# Altium project PowerBMS.PrjPcb
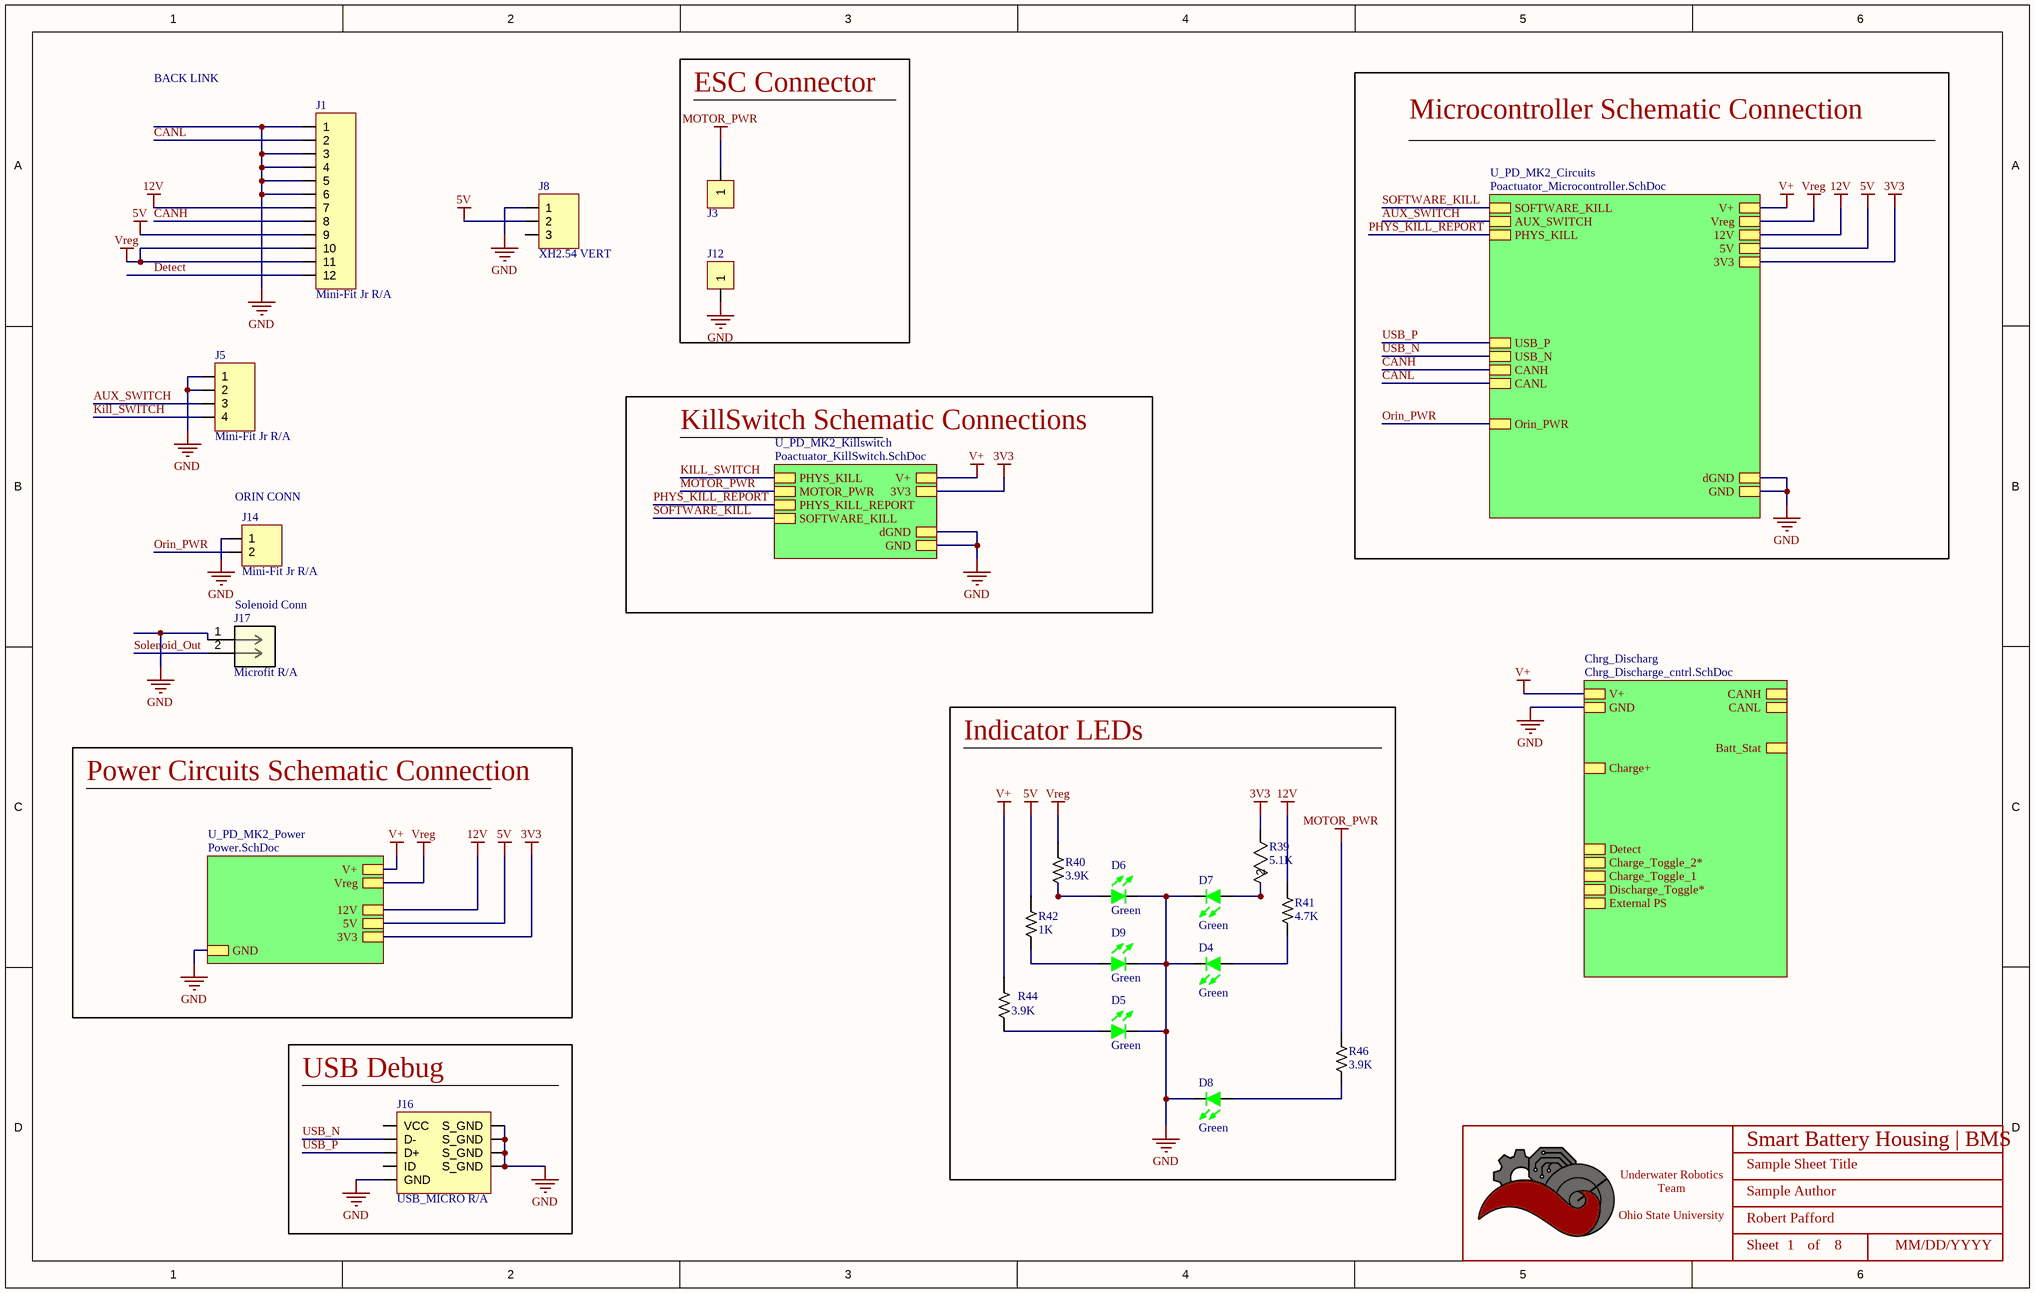
[diagram p0: Poactuator_Connectors.SchDoc]
BoardRevision: 1.1; DateOfDesignReview: 1/10/2022; ProjectTitle: Smart Battery Housing | BMS; TeamLead: Robert Pafford
5 sheets, 144 parts. Net scope: hierarchical (ports join the sheet entries above them; power ports are global).
Board file: SBM_BMS.PcbDoc
Sheets:
  Poactuator_Connectors.SchDoc
    U_PD_MK2_Circuits = Poactuator_Microcontroller.SchDoc
    U_PD_MK2_Killswitch = Poactuator_KillSwitch.SchDoc
    Chrg_Discharg = Chrg_Discharge_cntrl.SchDoc
      BMS = SBH_BMS.SchDoc

## Sheet Poactuator_Connectors.SchDoc: Sample Sheet Title
size B; Date: MM/DD/YYYY; Author: Sample Author; Organization: ORGANIZATION; Address1: ADDRESS 1; Address2: ADDRESS 2; Address3: ADDRESS 3; Address4: ADDRESS 4; Revision: -; SheetNumber: 1; SheetTotal: 8; ENG_APP_DATE: --/--/--; DSN_APP_DATE: --/--/--; CHK_APP_DATE: --/--/--

### Parts
(Parts that share a designator on the sheet are numbered #1, #2 ... from top to bottom, then left to right.)
*#1  Title_Block  [LOGO]  (value not drawn)  (graphical)
D4  Color: Green  [LED_0603]  (hidden comment: IN-S63AT5G)
D5  Color: Green  [LED_0603]  (hidden comment: IN-S63AT5G)
D6  Color: Green  [LED_0603]  (hidden comment: IN-S63AT5G)
D7  Color: Green  [LED_0603]  (hidden comment: IN-S63AT5G)
D8  Color: Green  [LED_0603]  (hidden comment: IN-S63AT5G)
D9  Color: Green  [LED_0603]  (hidden comment: IN-S63AT5G)
J1  Mini-Fit Jr R/A  [CONN_MOLEX_MINIFIT JR_12 POS_R/A]
J3  Redcube M4 Term 85A  [Redcube M4 Term 85A]  (value not drawn)
J5  Mini-Fit Jr R/A  [CONN_MOLEX_MINIFIT JR_4 POS_R/A]
J8  XH2.54 VERT  [CONN_JST_XH254_3POS_VERT]
J12  Redcube M4 Term 85A  [Redcube M4 Term 85A]  (value not drawn)
J14  Mini-Fit Jr R/A  [CONN_MOLEX_MINIFIT JR_2 POS_R/A]
J16  USB_MICRO R/A  [CONN_MINIUSB]
J17  Microfit R/A  [CONN_MOLEX_MICROFIT_2 POS_R/A]
R39  5.1K  [RESISTOR_0603]
R40  Value  (Ohms): 3.9K  [RESISTOR_0603]  (hidden comment: 3.9k Ohm 5% 1/10W)
R41  Value  (Ohms): 4.7K  [RESISTOR_0603]  (hidden comment: 4.7k Ohm 5% 1/10W)
R42  Value  (Ohms): 1K  [RESISTOR_0603]  (hidden comment: 1k Ohm 5% 1/8W)
R44  Value  (Ohms): 3.9K  [RESISTOR_0603]  (hidden comment: 3.9k Ohm 5% 1/10W)
R46  Value  (Ohms): 3.9K  [RESISTOR_0603]  (hidden comment: 3.9k Ohm 5% 1/10W)

### Blocks framed on the sheet
ESC Connector: J3 J12
Indicator LEDs: D4-D9 R39-R42 R44 R46
USB Debug: J16

### Sub-sheets
Chrg_Discharg = Chrg_Discharge_cntrl.SchDoc: CANH, CANL, V+, GND, Detect, Batt_Stat, Charge+, Charge_Toggle_2*, Charge_Toggle_1, Discharge_Toggle*, External PS
U_PD_MK2_Circuits = Poactuator_Microcontroller.SchDoc: GND, V+, 5V, 3V3, SOFTWARE_KILL, AUX_SWITCH, 12V, dGND, Vreg, USB_P, USB_N, CANH, CANL, PHYS_KILL, Orin_PWR
U_PD_MK2_Killswitch = Poactuator_KillSwitch.SchDoc: PHYS_KILL_REPORT, MOTOR_PWR, V+, 3V3, dGND, GND, PHYS_KILL, SOFTWARE_KILL
U_PD_MK2_Power = Power.SchDoc (file not in this document): GND, V+, 5V, 3V3, Vreg, 12V

### Nets
3V3: R39.1 ; sheet U_PD_MK2_Power/3V3, sheet U_PD_MK2_Circuits/3V3, sheet U_PD_MK2_Killswitch/3V3
5V: J1.9 J8.2 R42.1 ; sheet U_PD_MK2_Power/5V, sheet U_PD_MK2_Circuits/5V
12V: J1.7 R41.1 ; sheet U_PD_MK2_Power/12V, sheet U_PD_MK2_Circuits/12V
GND: D4.2 D5.2 D6.2 D7.2 D8.2 D9.2 J1.1 J1.3 J1.4 J1.5 J1.6 J5.1 J5.2 J8.1 J12.1 J14.1 J16.5(GND) J16.6(S_GND) J16.7(S_GND) J16.8(S_GND) J16.9(S_GND) J17.1 ; sheet U_PD_MK2_Power/GND, sheet U_PD_MK2_Circuits/GND, sheet U_PD_MK2_Circuits/dGND, sheet U_PD_MK2_Killswitch/dGND, sheet U_PD_MK2_Killswitch/GND, sheet Chrg_Discharg/GND  [project net dGND]
MOTOR_PWR: J3.1 R46.1 ; sheet U_PD_MK2_Killswitch/MOTOR_PWR
V+: R44.1 ; sheet U_PD_MK2_Power/V+, sheet U_PD_MK2_Circuits/V+, sheet U_PD_MK2_Killswitch/V+, sheet Chrg_Discharg/V+
Vreg: J1.10 J1.11 R40.1 ; sheet U_PD_MK2_Power/Vreg, sheet U_PD_MK2_Circuits/Vreg
AUX_SWITCH: J5.3 ; sheet U_PD_MK2_Circuits/AUX_SWITCH
CANH: J1.8 ; sheet U_PD_MK2_Circuits/CANH
CANL: J1.2 ; sheet U_PD_MK2_Circuits/CANL
Detect: J1.12
KILL_SWITCH: J5.4 ; sheet U_PD_MK2_Killswitch/PHYS_KILL
Orin_PWR: J14.2 ; sheet U_PD_MK2_Circuits/Orin_PWR
PHYS_KILL_REPORT: sheet U_PD_MK2_Circuits/PHYS_KILL, sheet U_PD_MK2_Killswitch/PHYS_KILL_REPORT
SOFTWARE_KILL: sheet U_PD_MK2_Circuits/SOFTWARE_KILL, sheet U_PD_MK2_Killswitch/SOFTWARE_KILL
Solenoid_Out: J17.2
USB_N: J16.2(D-) ; sheet U_PD_MK2_Circuits/USB_N
USB_P: J16.3(D+) ; sheet U_PD_MK2_Circuits/USB_P
NetD4_1: D4.1 R41.2
NetD5_1: D5.1 R44.2
NetD6_1: D6.1 R40.2
NetD7_1: D7.1 R39.2
NetD8_1: D8.1 R46.2
NetD9_1: D9.1 R42.2

Not connected (* = marked no-connect by the designer): J8 3; J16 1(VCC) 4(ID)

### Notes on the sheet
- BACK LINK
- Microcontroller Schematic Connection
- KillSwitch Schematic Connections
- (near J14) ORIN CONN
- (near J17) Solenoid Conn
- Power Circuits Schematic Connection
- DWG. NO.
- REV.
- SHT.
- THIS DOCUMENT AND THE DATA DISCLOSED HEREIN OR HEREWITH IS THE PROPERTY OF ALTIUM LIMITED AND MAY BE FREELY DISTRIBUTED IN WHOLE. NO RIGHTS ARE RESERVED OR EXPRESS OR IMPLIED WARANTEE GIVEN.
- REVISION
- DESCRIPTION
- DATE
- APPROVED
- ENG:
- APPROVALS
- PROJECT
- DSN:
- CHK:
- REFERENCE DOCUMENTS
- PROJECT REVISION:
- TITLE
- DOCUMENT REVISION:
- DESIGN ITEM:
- BOM:
- FAB DWG:
- PCB DWG:
- ASSY DWG:
- SCALE:
- SIZE
- B
- CAGE CODE
- FILE NAME
- DWG NO.
- SHEET
- OF
- REV
- (in symbol Title_Block) Underwater Robotics Team / Ohio State University; Sheet; of

### Library data of the parts
*#1 = Title_Block: UWRT Schematic Title Block Template / Created June 2021, Dylan Trainor
D4-D9 = LED_Green_0603_3V: LED Green Vf= 3V If = 0.005A / IN-S63AT5G; Made By: Robert Pafford; Forward Current: 5mA; ComponentLink1Description: Datasheet; ComponentLink1URL: https://www.we-online.de/katalog/datasheet/150060GS75000.pdf; Forward Voltage: 3V; Package: 0603; Supplier 1: Digi-Key; Supplier Part Number 1: 1830-1062-1-ND
J1 = CONN_MOLEX_MINIFIT JR_12POS_R/A: Molex Minifit Jr. 5569 / 12 Pos R/A Natural; Pitch: 4.2mm; Configuration: Right Angle; Current Per Pin: 13A; Number of Positions: 12; Manufacturer: Molex; Color: Natural; Created By: Flip B; ComponentLink1Description: Datasheet; ComponentLink1URL: https://www.molex.com/pdm_docs/ps/PS-5556-001.pdf; Series: Minifit Jr 5569; Supplier 1: Digi-Key; Supplier Part Number 1: WM21356-ND
J5 = CONN_MOLEX_MINIFIT JR_4POS_R/A: Molex Minifit Jr. 5569 / 4 Pos R/A Natural; Pitch: 4.2mm; Configuration: Right Angle; Current Per Pin: 13A; Number of Positions: 4; Supplier Part Number 1: WM13112-ND; Supplier 1: Digi-Key; Manufacturer: Molex; Color: Natural; Created By: Flip B; ComponentLink1Description: Datasheet; ComponentLink1URL: https://www.molex.com/pdm_docs/sd/026013115_sd.pdf; Series: Minifit Jr 5569
J8 = CONN_JST_XH254_3POS_VERT: JST XH 2.54mm Pitch 3 Pos Vertical; Current Per Pin: 4A; Number of Positions: 3; NOTE: Do not use JST 2.5mm parts with this footprint. JST does not make 2.54mm pitch pins, rather only clones make this connector!; Manufacturer: JST; Pitch: 2.54mm; Configuration: Vertical; Color: White; Created By: Robert P; Series: XH 2.54; ComponentLink1Description: Purchase Link; ComponentLink1URL: https://www.amazon.com/460PCS-XH2-54-Connector-Terminal-Connectors/dp/B09DBGVX5C
J14 = CONN_MOLEX_MINIFIT JR_2POS_R/A: Molex Minifit Jr. 5569 / 2 Pos R/A Natural; Pitch: 4.2mm; Configuration: Right Angle; Current Per Pin: 13A; Number of Positions: 2; Manufacturer: Molex; Color: Natural; Created By: Robert P; ComponentLink1Description: Datasheet; ComponentLink1URL: https://www.molex.com/pdm_docs/sd/026013115_sd.pdf; Series: Minifit Jr 5569; Supplier 1: Digi-Key; Supplier Part Number 1: WM1351-ND
J16 = CONN_MICROUSB: Amphenol Micro USB-B / USB2.0 5 Pin Right Angle SMD; Pitch: 0.65mm; Current Per Pin: 1.8A; Number of Positions: 5; Manufacturer: Amphenol; Configuration: Right Angle; Color: Silver; Created By: Flip B; ComponentLink1Description: Datasheet; ComponentLink1URL: https://cdn.amphenol-icc.com/media/wysiwyg/files/documentation/datasheet/inputoutput/io_usb_micro.pdf?__cf_chl_jschl_tk__=05693735e19256298f6ef6ca2bb2e65c376a4f56-1625503833-0-Abitsb0-ufjOXJYs_S3J3r2iTn-nObalbmXUksF1VvO_h_WEmRdMlUD1I8-hmWSEVWzY1pirKnrPZWfgY3851qyBZe5ZvnNQePLGIzUgdEIQBVUyW36RsbYpDLEWxJ4horD-5gChFgobLYqwmG5aHl0E8lIn_twwPPrOxilK2gP0q9t_CNOs_u5fMqXvXUrlsOv8tIE2NRlu6NVP8qtkL2GjhlkeTUbDMF8WvvpPDTFOgvZ4Y16Ej8F8AhWos88mo5B1HssXozw0XrkJQIqERITUu6rqloz9kf4ZzhBHtDAt-IkiAFY_Ds9SW8FYKKTtINJVpHZQ6Gyu1FFM4Dc9MO0maE8_mmNcwlxqyRoRk_MPWW8VyByXWM5RSp52jteRKw7FeI9WIYvCbPAOy0Eyib-aseIQsnGbglBcUY6_2xp8GYaJM38H3dNvBPsSOfJBPndKedwKHllxjkucXn6xsN0sDXkpGN-cu8_2bDTJ0g-uUucKSCooYX-ApSDNGpkA_p9zv1SOAD8c0zaZVmtiBsN75QpVz2rzq9_BFxOywPvR; Series: 10118192; Supplier 1: Digi-Key; Supplier Part Number 1: 609-4613-1-ND
J17 = CONN_MOLEX_MICROFIT_2 POS_R/A: CONN HEADER R/A 2POS; Manufacturer: Molex; Pitch: 3mm; Current Rating: 8A; Supplier 1: Digikey; Supplier Part Number 1: WM1813-ND; Configuration: R/A; Color: Black
R39 = ERA-3AEB512V_2: 5.1 kOhms ±0.1% 0.1W, 1/10W Chip Resistor 0603 (1608 Metric) Automotive AEC-Q200 Thin Film; Mfr_Name: Panasonic; Copyright: Copyright (C) 2023 Ultra Librarian. All rights reserved.; Manufacturer_Part_Number: ERA-3AEB512V; RefDes: RefDes; Type: DEV
R40 R44 R46 = RESISTOR_3.9K_0603: RES 3.9k OHM 1% 1/10W 0603; Tolerance: +/- 1%; Made By: Robert Pafford; Wattage: 1/10W; Supplier 1: Digi-Key; Supplier Part Number 1: P3.90KHCT-ND
R41 = RESISTOR_4.7K_0603: RES 4.7k OHM 5% 1/10W 0603; Tolerance: +/- 5%; Made By: Robert Pafford; Wattage: 1/10W; Supplier: Digikey; Digikey Part Numer: CR0603-JW-104ELFTR-ND; Supplier 1: Digi-Key; Supplier Part Number 1: RMCF0603JT4K70CT-ND
R42 = RESISTOR_1K_0603: RES 1k OHM 5% 1/8W 0603; Tolerance: +/- 5%; Made By: Robert Pafford; ComponentLink1Description: Datasheet; ComponentLink1URL: https://www.bourns.com/docs/product-datasheets/CRxxxxx.pdf; Wattage: 1/8W; Supplier: Digikey; Digikey Part Numer: CR0603-JW-104ELFTR-ND; Supplier 1: Digi-Key; Supplier Part Number 1: 2019-RK73B1JTTD102JCT-ND
J3 J12 = Redcube M4 Term 85A: Created By: Nahtan Ayer; Current Rating: 85 A; Screw Size: M4

## Sheet Poactuator_Microcontroller.SchDoc: Sample Sheet Title
size B; Date: MM/DD/YYYY; Author: Sample Author; Organization: ORGANIZATION; Address1: ADDRESS 1; Address2: ADDRESS 2; Address3: ADDRESS 3; Address4: ADDRESS 4; Revision: -; SheetNumber: 5; SheetTotal: 8; ENG_APP_DATE: --/--/--; DSN_APP_DATE: --/--/--; CHK_APP_DATE: --/--/--
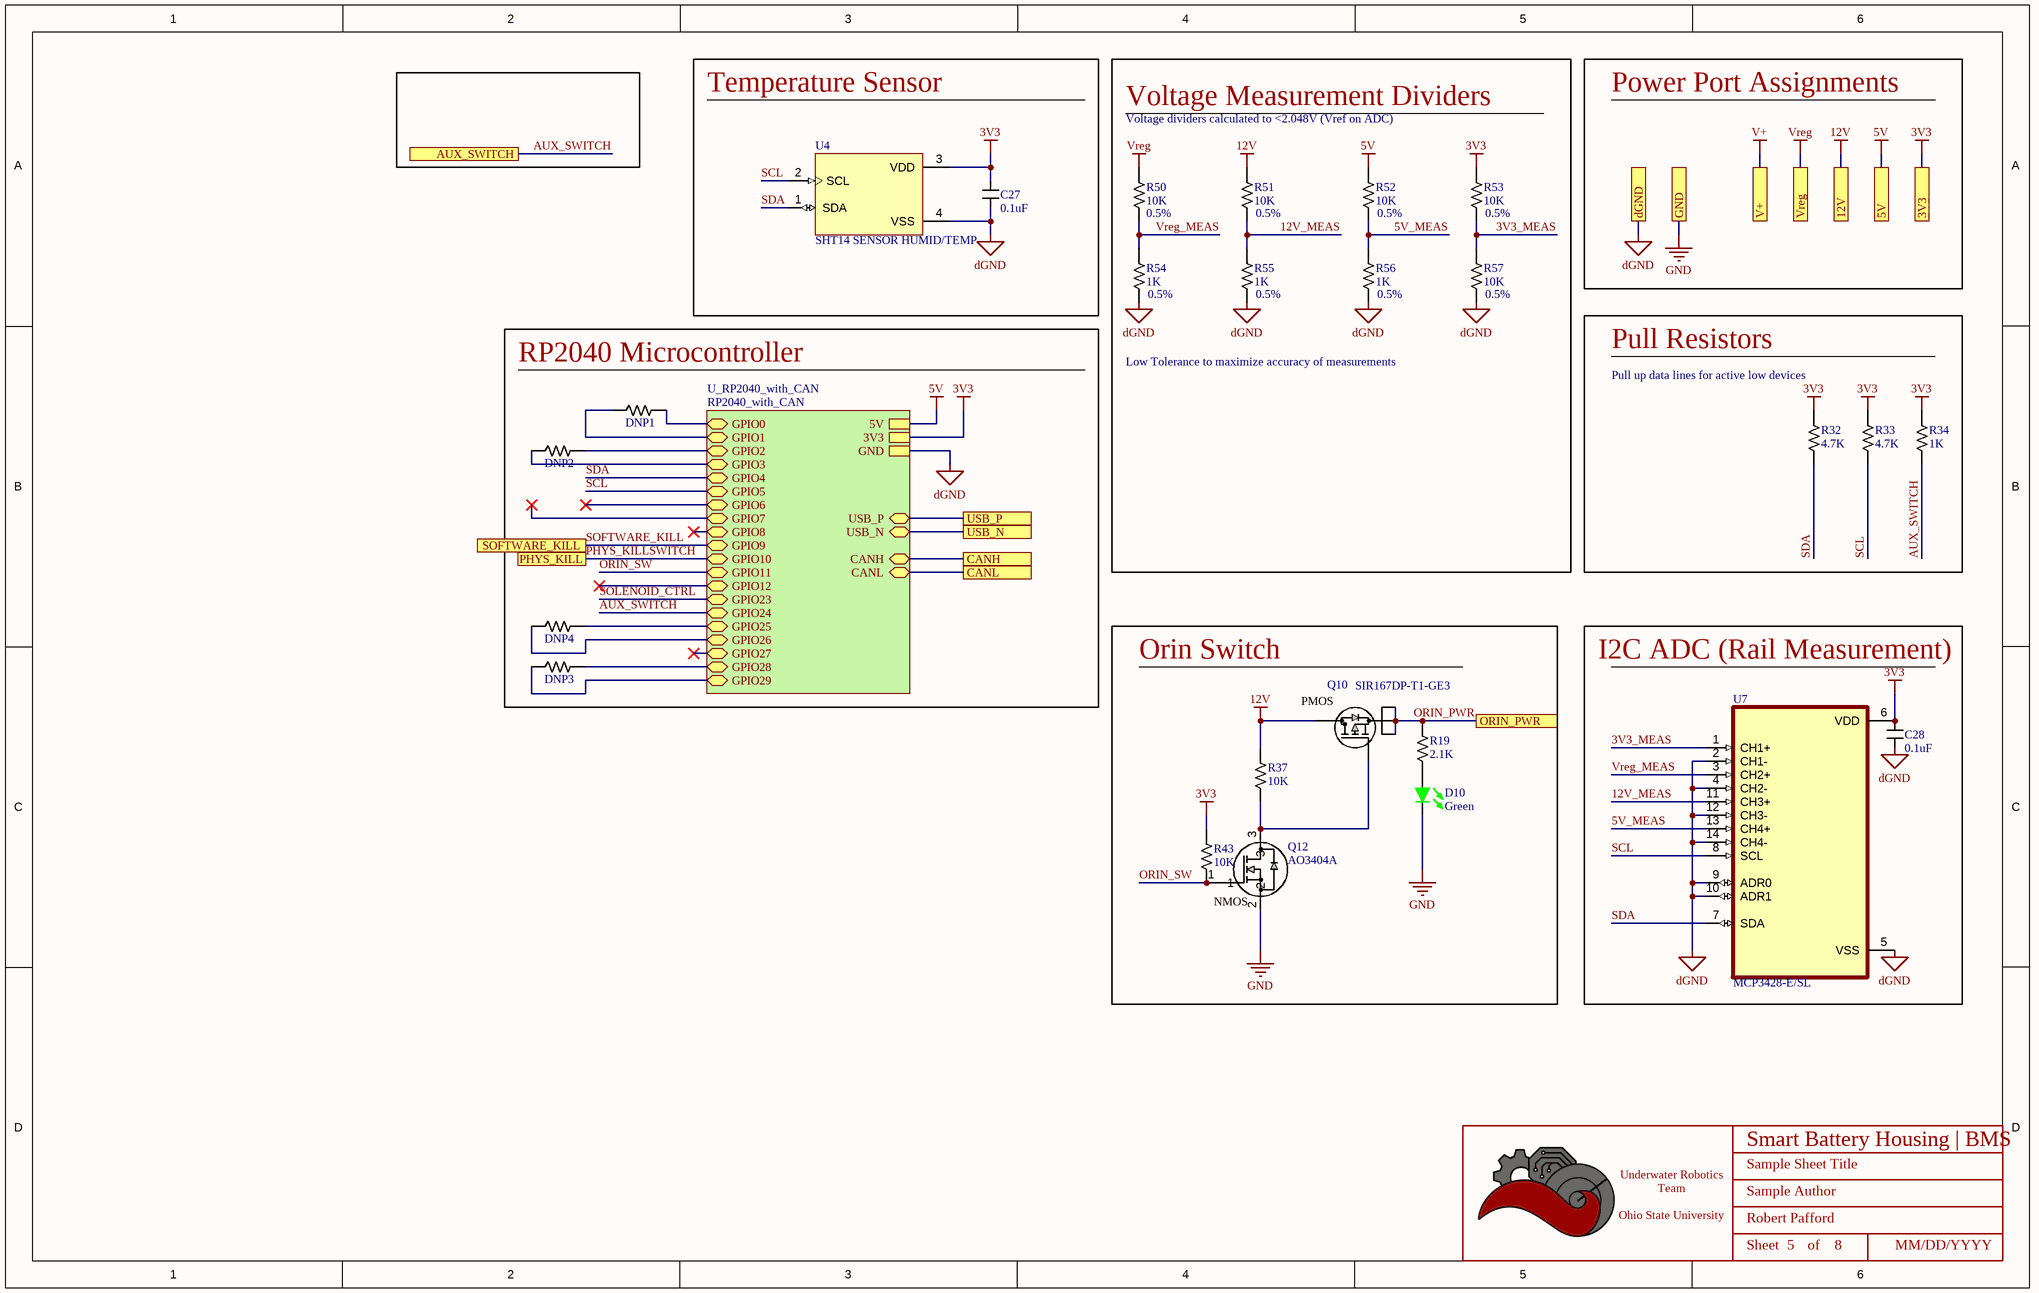
[diagram p1: Poactuator_Microcontroller.SchDoc]

### Parts
(Parts that share a designator on the sheet are numbered #1, #2 ... from top to bottom, then left to right.)
*#2  Title_Block  [LOGO]  (value not drawn)  (graphical)
C27  value 0.1uF  [CAPACITOR_0603]  (hidden comment: 100nF Ceramic 6.3V)
C28  value 0.1uF  [CAPACITOR_0603]  (hidden comment: 100nF Ceramic 6.3V)
D10  Color: Green  [LED_0603]  (hidden comment: IN-S63AT5G)
DNP1  DNP  [RESISTOR_0402]  (value not drawn)
DNP2  DNP  [RESISTOR_0402]  (value not drawn)
DNP3  DNP  [RESISTOR_0402]  (value not drawn)
DNP4  DNP  [RESISTOR_0402]  (value not drawn)
Q10  SIR167DP-T1-GE3  [MOSFET_7DP-T1-GE3_VIS]
Q12  AO3404A  [SOT-23-3]
R19  Value  (Ohms): 2.1K  [RESISTOR_0603]  (hidden comment: 2.1k Ohm 5% 1/8W)
R32  Value  (Ohms): 4.7K  [RESISTOR_0603]  (hidden comment: 4.7k Ohm 5% 1/10W)
R33  Value  (Ohms): 4.7K  [RESISTOR_0603]  (hidden comment: 4.7k Ohm 5% 1/10W)
R34  Value  (Ohms): 1K  [RESISTOR_0603]  (hidden comment: 1k Ohm 5% 1/8W)
R37  Value  (Ohms): 10K  [RESISTOR_0603]  (hidden comment: 10k Ohm 5% 1/10W)
R43  Value  (Ohms): 10K  [RESISTOR_0603]  (hidden comment: 10k Ohm 5% 1/10W)
R50  Value  (Ohms): 10K  [RESISTOR_0603]  (hidden comment: 10k Ohm 0.5% 1/10W)
R51  Value  (Ohms): 10K  [RESISTOR_0603]  (hidden comment: 10k Ohm 0.5% 1/10W)
R52  Value  (Ohms): 10K  [RESISTOR_0603]  (hidden comment: 10k Ohm 0.5% 1/10W)
R53  Value  (Ohms): 10K  [RESISTOR_0603]  (hidden comment: 10k Ohm 0.5% 1/10W)
R54  Value  (Ohms): 1K  [RESISTOR_0603]  (hidden comment: 1k Ohm 5% 1/10W)
R55  Value  (Ohms): 1K  [RESISTOR_0603]  (hidden comment: 1k Ohm 5% 1/10W)
R56  Value  (Ohms): 1K  [RESISTOR_0603]  (hidden comment: 1k Ohm 5% 1/10W)
R57  Value  (Ohms): 10K  [RESISTOR_0603]  (hidden comment: 10k Ohm 0.5% 1/10W)
U4  SHT14 SENSOR HUMID/TEMP  [XDCR_SHT41-AD1B-R2]
U7  MCP3428-E/SL  [SOIC127P600X175-14N]

### Blocks framed on the sheet
Temperature Sensor: C27 U4
RP2040 Microcontroller: DNP1-DNP4
Pull Resistors: R32-R34
Orin Switch: D10 Q10 Q12 R19 R37 R43
I2C ADC (Rail Measurement): C28 U7

### Sub-sheets
U_RP2040_with_CAN = RP2040_with_CAN (file not in this document): USB_P (bidir), USB_N (bidir), 5V, CANH (bidir), CANL (bidir), GPIO0 (bidir), GPIO1 (bidir), GPIO2 (bidir), GPIO3 (bidir), GPIO4 (bidir), GPIO5 (bidir), GPIO6 (bidir), GPIO7 (bidir), GPIO8 (bidir), GPIO9 (bidir), GPIO10 (bidir), GPIO11 (bidir), GPIO12 (bidir), GPIO23 (bidir), GPIO24 (bidir), GPIO25 (bidir), GPIO26 (bidir), GPIO27 (bidir), GPIO28 (bidir), GPIO29 (bidir), 3V3, GND

### Ports
3V3, 5V, 12V, AUX_SWITCH, CANH, CANL, dGND, GND, ORIN_PWR, PHYS_KILL, SOFTWARE_KILL, USB_N, USB_P, V+, Vreg

### Nets
3V3: C27.1 C28.1 R32.1 R33.1 R34.1 R43.1 R53.1 U4.3(VDD) U7.6(VDD) ; port 3V3, sheet U_RP2040_with_CAN/3V3
5V: R52.1 ; port 5V, sheet U_RP2040_with_CAN/5V
12V: Q10.D R37.1 R51.1 ; port 12V
dGND: C27.2 C28.2 D10.2 Q12.2 R54.2 R55.2 R56.2 R57.2 U4.4(VSS) U7.2(CH1-) U7.4(CH2-) U7.5(VSS) U7.9(ADR0) U7.10(ADR1) U7.12(CH3-) U7.14(CH4-) ; port GND, port dGND, sheet U_RP2040_with_CAN/GND  [also labelled GND]
Vreg: R50.1 ; port Vreg
3V3_MEAS: R53.2 R57.1 U7.1(CH1+)
5V_MEAS: R52.2 R56.1 U7.13(CH4+)
12V_MEAS: R51.2 R55.1 U7.11(CH3+)
AUX_SWITCH: R34.2 ; port AUX_SWITCH, sheet U_RP2040_with_CAN/GPIO24
CANH: port CANH, sheet U_RP2040_with_CAN/CANH
CANL: port CANL, sheet U_RP2040_with_CAN/CANL
Orin_PWR: Q10.1(S) Q10.2(S) Q10.3(S) R19.1 ; port ORIN_PWR
ORIN_SW: Q12.1 R43.2 ; sheet U_RP2040_with_CAN/GPIO11
PHYS_KILLSWITCH: port PHYS_KILL, sheet U_RP2040_with_CAN/GPIO10  [project net PHYS_KILL_REPORT]
SCL: R33.2 U4.2(SCL) U7.8(SCL) ; sheet U_RP2040_with_CAN/GPIO5
SDA: R32.2 U4.1(SDA) U7.7(SDA) ; sheet U_RP2040_with_CAN/GPIO4
SOFTWARE_KILL: port SOFTWARE_KILL, sheet U_RP2040_with_CAN/GPIO9
SOLENOID_CTRL: sheet U_RP2040_with_CAN/GPIO23
USB_N: port USB_N, sheet U_RP2040_with_CAN/USB_N
USB_P: port USB_P, sheet U_RP2040_with_CAN/USB_P
Vreg_MEAS: R50.2 R54.1 U7.3(CH2+)
NetD10_1: D10.1 R19.2
NetDNP1_1: DNP1.1 ; sheet U_RP2040_with_CAN/GPIO0
NetDNP1_2: DNP1.2 ; sheet U_RP2040_with_CAN/GPIO1
NetDNP2_1: DNP2.1 ; sheet U_RP2040_with_CAN/GPIO2
NetDNP2_2: DNP2.2 ; sheet U_RP2040_with_CAN/GPIO3
NetDNP3_1: DNP3.1 ; sheet U_RP2040_with_CAN/GPIO28
NetDNP3_2: DNP3.2 ; sheet U_RP2040_with_CAN/GPIO29
NetDNP4_1: DNP4.1 ; sheet U_RP2040_with_CAN/GPIO25
NetDNP4_2: DNP4.2 ; sheet U_RP2040_with_CAN/GPIO26
NetQ10_4: Q10.4(G) Q12.3 R37.2

### Notes on the sheet
- Power Port Assignments
- Voltage Measurement Dividers
- Voltage dividers calculated to <2.048V (Vref on ADC)
- (near R50) 0.5%
- (near R51) 0.5%
- (near R52) 0.5%
- (near R53) 0.5%
- (near R54) 0.5%
- (near R55) 0.5%
- (near R56) 0.5%
- (near R57) 0.5%
- Low Tolerance to maximize accuracy of measurements
- Pull up data lines for active low devices
- DWG. NO.
- REV.
- SHT.
- THIS DOCUMENT AND THE DATA DISCLOSED HEREIN OR HEREWITH IS THE PROPERTY OF ALTIUM LIMITED AND MAY BE FREELY DISTRIBUTED IN WHOLE. NO RIGHTS ARE RESERVED OR EXPRESS OR IMPLIED WARANTEE GIVEN.
- REVISION
- DESCRIPTION
- DATE
- APPROVED
- ENG:
- APPROVALS
- PROJECT
- DSN:
- CHK:
- REFERENCE DOCUMENTS
- PROJECT REVISION:
- TITLE
- DOCUMENT REVISION:
- DESIGN ITEM:
- BOM:
- FAB DWG:
- PCB DWG:
- ASSY DWG:
- SCALE:
- SIZE
- B
- CAGE CODE
- FILE NAME
- DWG NO.
- SHEET
- OF
- REV
- (in symbol AO3404A) NMOS
- (in symbol SIR167DP-T1-GE3) PMOS
- (in symbol Title_Block) Underwater Robotics Team / Ohio State University; Sheet; of

### Library data of the parts
*#2 = Title_Block: as *#1 on sheet Poactuator_Connectors
C27 C28 = CAPACITOR_0.1uF_0603: Cap 100nF 6.3V +/-10% / Ceramic 0603; Made By: Flip B; ComponentLink1Description: Datsheet; ComponentLink1URL: https://www.mouser.com/datasheet/2/212/KEM_C1002_X7R_SMD-1102033.pdf; Tolerance: +/- 10%; Voltage: 6.3V; Supplier 1: Digi-Key; Supplier Part Number 1: 399-15351-1-ND
D10 = LED_Green_0603_3V: as D4 on sheet Poactuator_Connectors; ComponentLink1Description: Datasheet; ComponentLink1URL: https://www.we-online.de/katalog/datasheet/150060GS75000.pdf; Forward Voltage: 3V; Package: 0603; Supplier 1: Digi-Key; Supplier Part Number 1: 1830-1062-1-ND
DNP1-DNP4 = DNP_0402: Do Not Populate 0402
Q10 = SIR167DP-T1-GE3: P-Channel 30 V 60A (Tc) 65.8W (Tc) Surface Mount PowerPAK® SO-8; Mfr_Name: Vishay; Type: DEV; Copyright: Copyright (C) 2022 Ultra Librarian. All rights reserved.; Manufacturer_Part_Number: SIR167DP-T1-GE3; RefDes: RefDes; Supplier 1: Mouser; Supplier Part Number 1: 78-SIR167DP-T1-GE3
Q12 = AO3404A: N-Channel 30 V 5.8A (Ta) 1.4W (Ta) Surface Mount SOT-23-3; Vendor: Alpha & Omega Semiconductor Inc.; SourceLibrary: ON_Semiconductor_2020-01-13; Vgs (Max): 3V @ 5.8A, 10V; Vgs (th): 3V @ 250µA; Vdss: 30V; Rds (on): 28mOhm @ 5.8A, 10V; Amp Rating: 5.8 A; FET Type: N-Channel; Package: SOT23-3L; Manufacturer _Part_Number: AO3404A; Power Dissipation: 1.4W (Ta); Supplier 1: Digi-Key; Supplier Part Number 1: 785-1004-1-ND; Created By: Dylan T
R19 = RESISTOR_2.1K_0603: RES 2.1k OHM 5% 1/8W 0603; Tolerance: +/- 5%; Made By: Robert Pafford; ComponentLink1Description: Datasheet; ComponentLink1URL: https://www.bourns.com/docs/product-datasheets/CRxxxxx.pdf; Wattage: 1/8W; Supplier: Digikey; Digikey Part Numer: CR0603-JW-104ELFTR-ND; Supplier 1: Digi-Key; Supplier Part Number 1: YAG1852CT-ND
R32 R33 = RESISTOR_4.7K_0603: as R41 on sheet Poactuator_Connectors; Wattage: 1/10W; Supplier: Digikey; Digikey Part Numer: CR0603-JW-104ELFTR-ND; Supplier 1: Digi-Key; Supplier Part Number 1: RMCF0603JT4K70CT-ND
R34 = RESISTOR_1K_0603: as R42 on sheet Poactuator_Connectors; ComponentLink1Description: Datasheet; ComponentLink1URL: https://www.bourns.com/docs/product-datasheets/CRxxxxx.pdf; Wattage: 1/8W; Supplier: Digikey; Digikey Part Numer: CR0603-JW-104ELFTR-ND; Supplier 1: Digi-Key; Supplier Part Number 1: 2019-RK73B1JTTD102JCT-ND
R37 R43 = RESISTOR_10K_0603: RES 10k OHM 5% 1/10W 0603; Tolerance: +/- 5%; Wattage: 1/8W; Made By: Robert Pafford; ComponentLink1Description: Datasheet; ComponentLink1URL: https://www.bourns.com/docs/product-datasheets/CRxxxxx.pdf; Supplier: Digikey; Digikey Part Numer: CR0603-JW-104ELFTR-ND; Supplier 1: Digi-Key; Supplier Part Number 1: 2019-RK73B1JTTD103JCT-ND
R50-R53 R57 = RESISTOR_10K_0.5%_0603: RES 10k OHM 0.5% 1/10W 0603; Tolerance: +/- 0.5%; Made By: Robert Pafford; Wattage: 1/10W; Supplier: Digikey; Digikey Part Numer: CR0603-JW-104ELFTR-ND; Supplier 1: Digi-Key; Supplier Part Number 1: 749-1695-1-ND
R54-R56 = RESISTOR_1K_0.5%_0603: RES 1k OHM 0.5% 1/10W 0603; Tolerance: +/- 0.5%; Made By: Robert Pafford; Wattage: 1/10W; Supplier: Digikey; Digikey Part Numer: CR0603-JW-104ELFTR-ND; Supplier 1: Digi-Key; Supplier Part Number 1: 749-1693-1-ND
U4 = SHT41-AD1B-R2: Digital Relative Humidity Temperature Sensor, Â±1.8 / max 2.5 %RH, Â±0.2 Â°C, Ultra-Low-Power; MF: Sensirion; Price: None; SnapEDA_Link: https://www.snapeda.com/parts/SHT41-AD1B-R2/Sensirion/view-part/?ref=snap; MP: SHT41-AD1B-R2; Purchase-URL: https://pricing.snapeda.com/search/part/SHT41-AD1B-R2/?ref=eda; Value: *; Availability: In Stock; Package: None; Check_prices: https://www.snapeda.com/parts/SHT41-AD1B-R2/Sensirion/view-part/?ref=eda; Supplier 1: Digi-Key; Supplier Part Number 1: 1649-SHT41-AD1B-R2CT-ND
U7 = MCP3428-E/SL: 16 Bit Analog to Digital Converter 4 Input 1 Sigma-Delta 14-SOIC; MF: Microchip; Package: SOIC-14 Microchip; SnapEDA_Link: https://www.snapeda.com/parts/MCP3428-E/SL/Microchip/view-part/13249/?ref=snap; MP: MCP3428-E/SL; Price: None; Availability: Unavailable; Value: *; Supplier 1: Digikey; Supplier Part Number 1: MCP3428-E/SL-ND

## Sheet Poactuator_KillSwitch.SchDoc: Sample Sheet Title
size B; Date: MM/DD/YYYY; Author: Sample Author; Organization: ORGANIZATION; Address1: ADDRESS 1; Address2: ADDRESS 2; Address3: ADDRESS 3; Address4: ADDRESS 4; Revision: -; SheetNumber: 4; SheetTotal: 7; ENG_APP_DATE: --/--/--; DSN_APP_DATE: --/--/--; CHK_APP_DATE: --/--/--
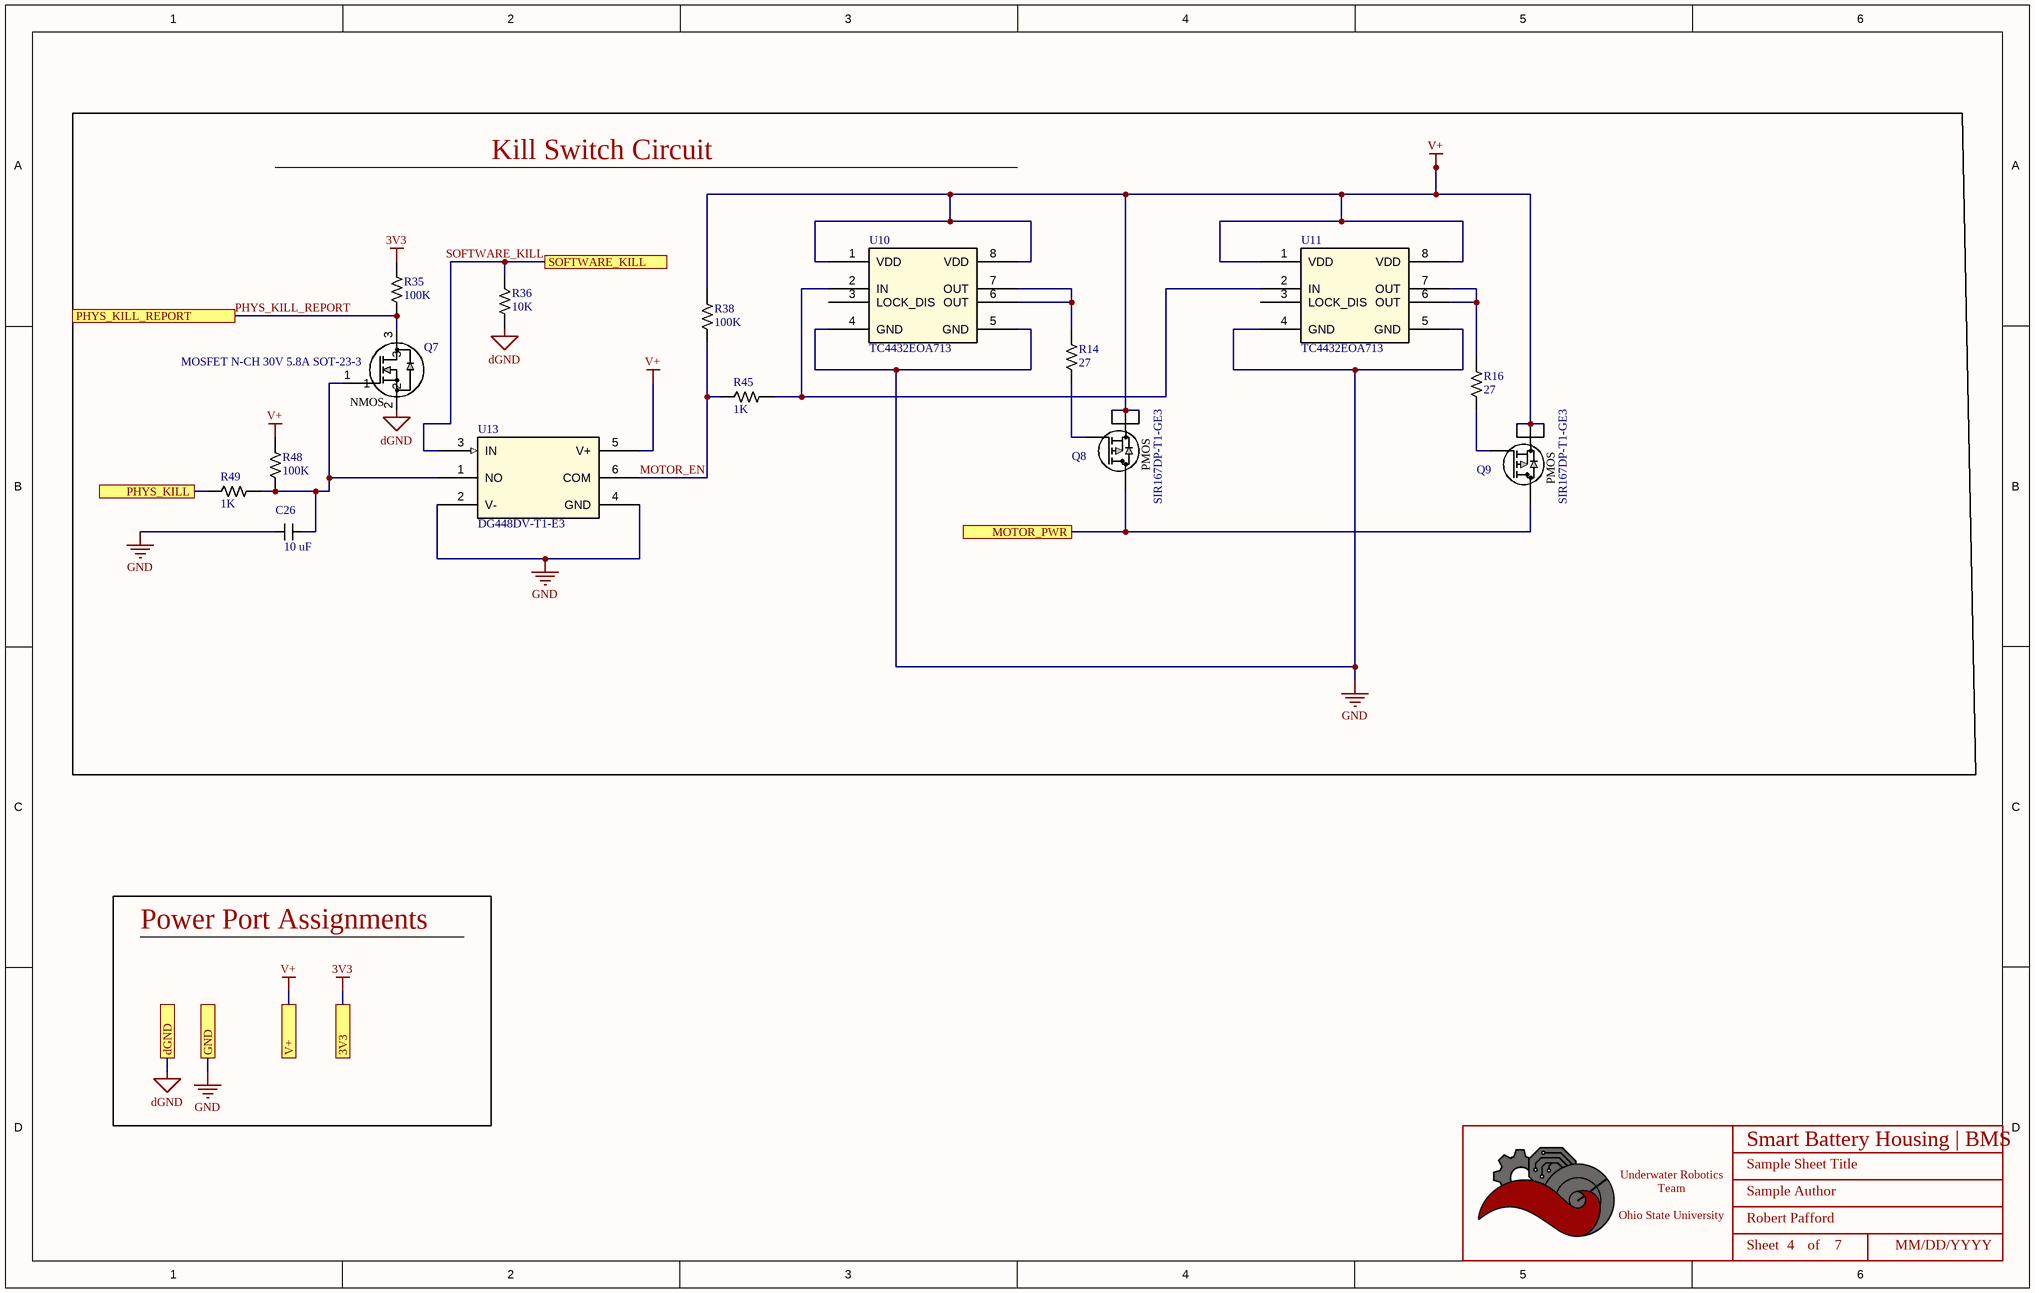
[diagram p2: Poactuator_KillSwitch.SchDoc]

### Parts
(Parts that share a designator on the sheet are numbered #1, #2 ... from top to bottom, then left to right.)
*#3  Title_Block  [LOGO]  (value not drawn)  (graphical)
C26  Value (uF): 10 uF  [CAPACITOR_1206]  (hidden comment: 10uF Ceramic 25V)
Q7  MOSFET N-CH 30V 5.8A SOT-23-3  [SOT-23-3]
Q8  SIR167DP-T1-GE3  [MOSFET_7DP-T1-GE3_VIS]
Q9  SIR167DP-T1-GE3  [MOSFET_7DP-T1-GE3_VIS]
R14  Value  (Ohms): 27  [RESISTOR_0603]  (hidden comment: 27 Ohm 5% 1/8W)
R16  Value  (Ohms): 27  [RESISTOR_0603]  (hidden comment: 27 Ohm 5% 1/8W)
R35  Value  (Ohms): 100K  [RESISTOR_0603]  (hidden comment: 100k Ohm 0.5% 1/10W)
R36  Value  (Ohms): 10K  [RESISTOR_0603]  (hidden comment: 10k Ohm 5% 1/10W)
R38  Value  (Ohms): 100K  [RESISTOR_0603]  (hidden comment: 100k Ohm 5% 1/8W)
R45  Value  (Ohms): 1K  [RESISTOR_0402]  (hidden comment: 1k Ohm 1% 1/16W)
R48  Value  (Ohms): 100K  [RESISTOR_0603]  (hidden comment: 100k Ohm 0.5% 1/10W)
R49  Value  (Ohms): 1K  [RESISTOR_0603]  (hidden comment: 1k Ohm 5% 1/8W)
U10  TC4432EOA713  [SOIC8-N_MC_MCH]
U11  TC4432EOA713  [SOIC8-N_MC_MCH]
U13  DG448DV-T1-E3  [TSOP6_DG_VIS-M]

### Blocks framed on the sheet
Kill Switch Circuit: C26 Q7-Q9 R14 R16 R35 R36 R38 R45 R48 R49 U10 U11 U13

### Ports
3V3, dGND, GND, MOTOR_PWR, PHYS_KILL, PHYS_KILL_REPORT, SOFTWARE_KILL, V+

### Nets
3V3: R35.1 ; port 3V3
dGND: C26.2 Q7.2 R36.1 U10.4(GND) U10.5(GND) U11.4(GND) U11.5(GND) U13.2(V-) U13.4(GND) ; port GND, port dGND  [also labelled GND]
MOTOR_PWR: Q8.D Q9.D ; port MOTOR_PWR
V+: Q8.1(S) Q8.2(S) Q8.3(S) Q9.1(S) Q9.2(S) Q9.3(S) R38.1 R48.1 U10.1(VDD) U10.8(VDD) U11.1(VDD) U11.8(VDD) U13.5(V+) ; port V+
KILL_SWITCH: R49.2 ; port PHYS_KILL
MOTOR_EN: R38.2 R45.2 U13.6(COM)
PHYS_KILL_REPORT: Q7.3 R35.2 ; port PHYS_KILL_REPORT
SOFTWARE_KILL: R36.2 U13.3(IN) ; port SOFTWARE_KILL
NetC26_1: C26.1 Q7.1 R48.2 R49.1 U13.1(NO)
NetQ8_4: Q8.4(G) R14.2
NetQ9_4: Q9.4(G) R16.2
NetR14_1: R14.1 U10.6(OUT) U10.7(OUT)
NetR16_1: R16.1 U11.6(OUT) U11.7(OUT)
NetR45_1: R45.1 U10.2(IN) U11.2(IN)

Not connected (* = marked no-connect by the designer): U10 3(LOCK_DIS); U11 3(LOCK_DIS)

### Notes on the sheet
- Power Port Assignments
- DWG. NO.
- REV.
- SHT.
- THIS DOCUMENT AND THE DATA DISCLOSED HEREIN OR HEREWITH IS THE PROPERTY OF ALTIUM LIMITED AND MAY BE FREELY DISTRIBUTED IN WHOLE. NO RIGHTS ARE RESERVED OR EXPRESS OR IMPLIED WARANTEE GIVEN.
- REVISION
- DESCRIPTION
- DATE
- APPROVED
- ENG:
- APPROVALS
- PROJECT
- DSN:
- CHK:
- REFERENCE DOCUMENTS
- PROJECT REVISION:
- TITLE
- DOCUMENT REVISION:
- DESIGN ITEM:
- BOM:
- FAB DWG:
- PCB DWG:
- ASSY DWG:
- SCALE:
- SIZE
- B
- CAGE CODE
- FILE NAME
- DWG NO.
- SHEET
- OF
- REV
- (in symbol AO3404A) NMOS
- (in symbol SIR167DP-T1-GE3) PMOS
- (in symbol Title_Block) Underwater Robotics Team / Ohio State University; Sheet; of

### Library data of the parts
*#3 = Title_Block: as *#1 on sheet Poactuator_Connectors
C26 = CAPACITOR_10uF_1206: Cap 10uF 25V +/-10% / Ceramic 1206; Made By: Robert Pafford; Tolerance: +/- 10%; Voltage: 25V; Supplier 1: Digi-Key; Supplier Part Number 1: 1276-1804-6-ND
Q7 = AO3404A: N-Channel 30 V 5.8A (Ta) 1.4W (Ta) Surface Mount SOT-23-3; Vendor: Alpha & Omega Semiconductor Inc.; SourceLibrary: ON_Semiconductor_2020-01-13; Vgs (Max): 3V @ 5.8A, 10V; Vgs (th): 3V @ 250µA; Rds (on): 28mOhm @ 5.8A, 10V; Amp Rating: 5.8 A; FET Type: N-Channel; Package: SOT23-3L; Manufacturer _Part_Number: AO3404A; Vdss: 30V; Power Dissipation: 1.4W (Ta); Supplier 1: Digi-Key; Supplier Part Number 1: 785-1004-1-ND; Created By: Dylan T
Q8 Q9 = SIR167DP-T1-GE3: as Q10 on sheet Poactuator_Microcontroller; Copyright: Copyright (C) 2022 Ultra Librarian. All rights reserved.; Manufacturer_Part_Number: SIR167DP-T1-GE3; RefDes: RefDes; Supplier 1: Mouser; Supplier Part Number 1: 78-SIR167DP-T1-GE3
R14 R16 = RESISTOR_27_0603: RES 27 OHM 5% 1/8W 0603; Tolerance: +/- 5%; Made By: Robert Pafford; ComponentLink1Description: Datasheet; ComponentLink1URL: https://www.bourns.com/docs/product-datasheets/CRxxxxx.pdf; Wattage: 1/8W; Supplier: Digikey; Digikey Part Numer: CR0603-JW-104ELFTR-ND; Supplier 1: Digi-Key; Supplier Part Number 1: 2019-RK73B1JTTD270JCT-ND
R35 R48 = RESISTOR_100K_0.5%_0603: RES 100k OHM 0.5% 1/10W 0603; Tolerance: +/- 0.5%; Made By: John Ulm; ComponentLink1Description: Datasheet; ComponentLink1URL: https://www.bourns.com/docs/product-datasheets/CRxxxxx.pdf; Wattage: 1/10W; Supplier: Digikey; Digikey Part Numer: CR0603-JW-104ELFTR-ND; Supplier 1: Digi-Key; Supplier Part Number 1: 311-2395-1-ND
R36 = RESISTOR_10K_0603: as R37 on sheet Poactuator_Microcontroller; ComponentLink1Description: Datasheet; ComponentLink1URL: https://www.bourns.com/docs/product-datasheets/CRxxxxx.pdf; Supplier: Digikey; Digikey Part Numer: CR0603-JW-104ELFTR-ND; Supplier 1: Digi-Key; Supplier Part Number 1: 2019-RK73B1JTTD103JCT-ND
R38 = RESISTOR_100K_0603: RES 100k OHM 5% 1/10W 0603; Tolerance: +/- 5%; Made By: Flip B; ComponentLink1Description: Datasheet; ComponentLink1URL: https://www.bourns.com/docs/product-datasheets/CRxxxxx.pdf; Wattage: 1/10W; Supplier: Digikey; Digikey Part Numer: CR0603-JW-104ELFTR-ND; Supplier 1: Digi-Key; Supplier Part Number 1: CR0603-JW-104ELFCT-ND
R45 = RESISTOR_1K_0402: RES 1k OHM 1% 1/16W 0402; Tolerance: +/- 1%; Made By: Robert Pafford; Wattage: 1/16W; Supplier: Digikey; Digikey Part Numer: CR0603-JW-104ELFTR-ND; Supplier 1: Digi-Key; Supplier Part Number 1: 13-AC0402FR-131KLCT-ND
R49 = RESISTOR_1K_0603: as R42 on sheet Poactuator_Connectors; ComponentLink1Description: Datasheet; ComponentLink1URL: https://www.bourns.com/docs/product-datasheets/CRxxxxx.pdf; Wattage: 1/8W; Supplier: Digikey; Digikey Part Numer: CR0603-JW-104ELFTR-ND; Supplier 1: Digi-Key; Supplier Part Number 1: 2019-RK73B1JTTD102JCT-ND
U10 U11 = TC4432EOA713: High-Side or Low-Side Gate Driver IC Non-Inverting 8-SOIC; Mfr_Name: Microchip; Copyright: Copyright (C) 2024 Ultra Librarian. All rights reserved.; Manufacturer_Part_Number: TC4432EOA713; RefDes: RefDes; Type: DEV; Supplier 1: Digikey; Supplier Part Number 1: TC4432EOA713CT-ND
U13 = DG448DV-T1-E3: IC SWITCH SPST-NOX1 25OHM 6TSOP; Mfr_Name: Vishay; Copyright: Copyright (C) 2024 Ultra Librarian. All rights reserved.; Manufacturer_Part_Number: DG448DV-T1-E3; RefDes: RefDes; Type: DEV; Supplier 1: Mouser; Supplier Part Number 1: 781-DG448DV-E3

## Sheet Chrg_Discharge_cntrl.SchDoc: Charge/Discharge Protection
size B; Date: 04/05/2025; Author: John Ulm; DrawnBy: John Ulm; Organization: ORGANIZATION; Address1: ADDRESS 1; Address2: ADDRESS 2; Address3: ADDRESS 3; Address4: ADDRESS 4; Revision: -; SheetNumber: 5; SheetTotal: 8; ENG_APP_DATE: --/--/--; DSN_APP_DATE: --/--/--; CHK_APP_DATE: --/--/--
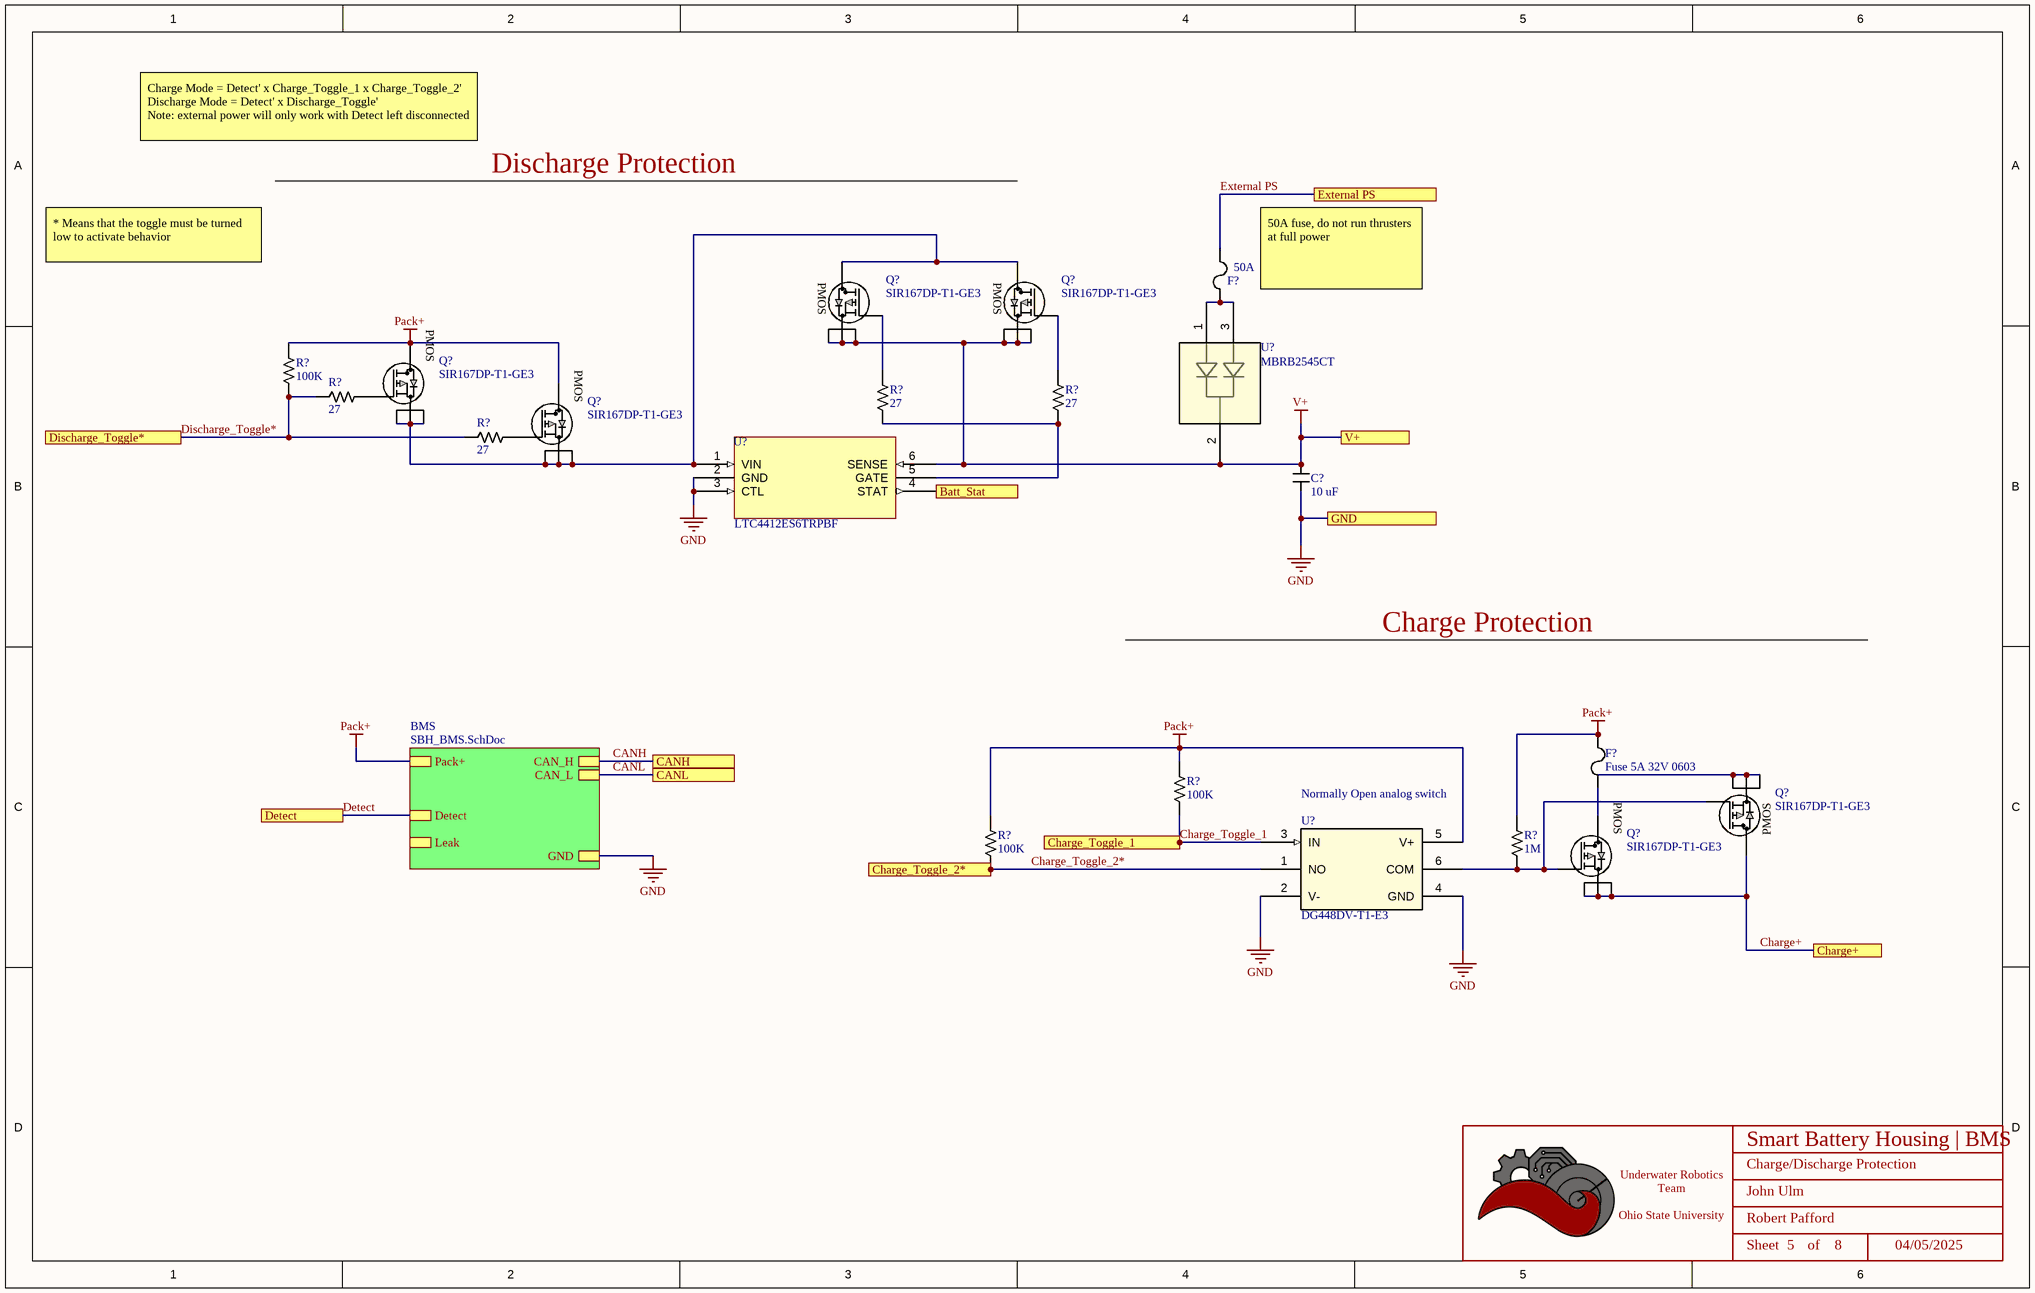
[diagram p3: Chrg_Discharge_cntrl.SchDoc]

### Parts
(Parts that share a designator on the sheet are numbered #1, #2 ... from top to bottom, then left to right.)
*#4  Title_Block  [LOGO]  (value not drawn)  (graphical)
C?  Value (uF): 10 uF  [CAPACITOR_1206]  (hidden comment: 10uF Ceramic 25V)
F?#1  Current Rating: 50A  [UHS]  (hidden comment: 3-140-167)
F?#2  Fuse 5A 32V 0603  [2-SMD Fuse 0603]
Q?#1  SIR167DP-T1-GE3  [MOSFET_7DP-T1-GE3_VIS]
Q?#2  SIR167DP-T1-GE3  [MOSFET_7DP-T1-GE3_VIS]
Q?#3  SIR167DP-T1-GE3  [MOSFET_7DP-T1-GE3_VIS]
Q?#4  SIR167DP-T1-GE3  [MOSFET_7DP-T1-GE3_VIS]
Q?#5  SIR167DP-T1-GE3  [MOSFET_7DP-T1-GE3_VIS]
Q?#6  SIR167DP-T1-GE3  [MOSFET_7DP-T1-GE3_VIS]
R?#1  Value  (Ohms): 100K  [RESISTOR_0603]  (hidden comment: 100k Ohm 5% 1/8W)
R?#2  Value  (Ohms): 27  [RESISTOR_0603]  (hidden comment: 27 Ohm 5% 1/8W)
R?#3  Value  (Ohms): 27  [RESISTOR_0603]  (hidden comment: 27 Ohm 5% 1/8W)
R?#4  Value  (Ohms): 27  [RESISTOR_0603]  (hidden comment: 27 Ohm 5% 1/8W)
R?#5  Value  (Ohms): 27  [RESISTOR_0603]  (hidden comment: 27 Ohm 5% 1/8W)
R?#6  Value  (Ohms): 100K  [RESISTOR_0603]  (hidden comment: 100k Ohm 5% 1/8W)
R?#7  Value  (Ohms): 100K  [RESISTOR_0603]  (hidden comment: 100k Ohm 5% 1/8W)
R?#8  1M  [RESISTOR_0603]
U?#1  MBRB2545CT  [D2PAK_VIS]
U?#2  LTC4412ES6TRPBF  [TSOT-23_S6]
U?#3  DG448DV-T1-E3  [TSOP6_DG_VIS-M]

### Sub-sheets
BMS = SBH_BMS.SchDoc: Pack+, GND, Detect, Leak, CAN_H, CAN_L

### Ports
Batt_Stat, CANH, CANL, Charge+, Charge_Toggle_1, Charge_Toggle_2*, Detect, Discharge_Toggle*, External PS, GND, V+

### Nets
GND: C?.2 U?#2.2(GND) U?#2.3(CTL) U?#3.2(V-) U?#3.4(GND) ; port GND, sheet BMS/GND  [project net dGND]
Pack+: F?#2.2 Q?#3.D Q?#4.D R?#1.1 R?#6.1 R?#7.1 R?#8.1 U?#3.5(V+) ; sheet BMS/Pack+
V+: C?.1 Q?#1.1(S) Q?#1.2(S) Q?#1.3(S) Q?#2.1(S) Q?#2.2(S) Q?#2.3(S) U?#1.2 U?#2.6(SENSE) ; port V+
CANH: port CANH, sheet BMS/CAN_H  [project net CAN_H]
CANL: port CANL, sheet BMS/CAN_L  [project net CAN_L]
Charge+: Q?#5.D Q?#6.1(S) Q?#6.2(S) Q?#6.3(S) ; port Charge+
Charge_Toggle_1: R?#6.2 U?#3.3(IN) ; port Charge_Toggle_1
Charge_Toggle_2*: R?#7.2 U?#3.1(NO) ; port Charge_Toggle_2*
Detect: port Detect, sheet BMS/Detect
Discharge_Toggle*: R?#1.2 R?#2.2 R?#5.2 ; port Discharge_Toggle*
External PS: F?#1.2 ; port External PS
NetF?#1_1: F?#1.1 U?#1.1 U?#1.3
NetF?#2_1: F?#2.1 Q?#6.D
NetQ?#1_4: Q?#1.4(G) R?#3.1
NetQ?#1_D: Q?#1.D Q?#2.D Q?#3.1(S) Q?#3.2(S) Q?#3.3(S) Q?#4.1(S) Q?#4.2(S) Q?#4.3(S) U?#2.1(VIN)
NetQ?#2_4: Q?#2.4(G) R?#4.1
NetQ?#3_4: Q?#3.4(G) R?#2.1
NetQ?#4_4: Q?#4.4(G) R?#5.1
NetQ?#5_1: Q?#5.1(S) Q?#5.2(S) Q?#5.3(S)
NetQ?#5_4: Q?#5.4(G) Q?#6.4(G) R?#8.2 U?#3.6(COM)
NetR?#3_2: R?#3.2 R?#4.2 U?#2.5(GATE)
NetU?#2_4: U?#2.4(STAT) ; port Batt_Stat

### Notes on the sheet
- Charge Mode = Detect' x Charge_Toggle_1 x Charge_Toggle_2'  Discharge Mode = Detect' x Discharge_Toggle'                         Note: external power will only work with Detect left disconnected
- Discharge Protection
- * Means that the toggle must be turned low to activate behavior
- 50A fuse, do not run thrusters at full power
- Charge Protection
- Normally Open analog switch
- DWG. NO.
- REV.
- SHT.
- THIS DOCUMENT AND THE DATA DISCLOSED HEREIN OR HEREWITH IS THE PROPERTY OF ALTIUM LIMITED AND MAY BE FREELY DISTRIBUTED IN WHOLE. NO RIGHTS ARE RESERVED OR EXPRESS OR IMPLIED WARANTEE GIVEN.
- REVISION
- DESCRIPTION
- DATE
- APPROVED
- ENG:
- APPROVALS
- PROJECT
- DSN:
- CHK:
- REFERENCE DOCUMENTS
- PROJECT REVISION:
- TITLE
- DOCUMENT REVISION:
- DESIGN ITEM:
- BOM:
- FAB DWG:
- PCB DWG:
- ASSY DWG:
- SCALE:
- SIZE
- B
- CAGE CODE
- FILE NAME
- DWG NO.
- SHEET
- OF
- REV
- (in symbol SIR167DP-T1-GE3) PMOS
- (in symbol Title_Block) Underwater Robotics Team / Ohio State University; Sheet; of

### Library data of the parts
*#4 = Title_Block: as *#1 on sheet Poactuator_Connectors
C? = CAPACITOR_10uF_1206: as C26 on sheet Poactuator_KillSwitch; Tolerance: +/- 10%; Voltage: 25V; Supplier 1: Digi-Key; Supplier Part Number 1: 1276-1804-6-ND
F?#1 = UHS Fuse 50A: 50 A AC 32 V DC Fuse Board Mount (Cartridge Style Excluded) Surface Mount 2-SMD, J-Lead; Mfr_Name: SCHURTER Inc.; Voltage Rating: 32VDC; Supplier 1: Digikey; Supplier Part Number 1: 486-3-140-167-ND; Manufacturer_Part_Number: 3-140-167; Response Time: *
F?#2 = ERB-RE5R00V: Pansonic | 32V | 5A | 0603 | Fast Blow; Mfr_Name: Panasonic; Breaking Capacity: 150A; Manufacturer_Part_Number: ERB-RE5R00V; Current Rating: 5A; Voltage Rating: 32V; Response Time: Fast Blow; Package: 1206; Created By: Robert Pafford; Supplier 1: Digi-Key; Supplier Part Number 1: P15125CT-ND
Q?#1-Q?#6 = SIR167DP-T1-GE3: as Q10 on sheet Poactuator_Microcontroller; Copyright: Copyright (C) 2022 Ultra Librarian. All rights reserved.; Manufacturer_Part_Number: SIR167DP-T1-GE3; RefDes: RefDes; Supplier 1: Mouser; Supplier Part Number 1: 78-SIR167DP-T1-GE3
R?#1 R?#6 R?#7 = RESISTOR_100K_0603: as R38 on sheet Poactuator_KillSwitch; ComponentLink1Description: Datasheet; ComponentLink1URL: https://www.bourns.com/docs/product-datasheets/CRxxxxx.pdf; Wattage: 1/10W; Supplier: Digikey; Digikey Part Numer: CR0603-JW-104ELFTR-ND; Supplier 1: Digi-Key; Supplier Part Number 1: CR0603-JW-104ELFCT-ND
R?#2-R?#5 = RESISTOR_27_0603: as R14 on sheet Poactuator_KillSwitch; ComponentLink1Description: Datasheet; ComponentLink1URL: https://www.bourns.com/docs/product-datasheets/CRxxxxx.pdf; Wattage: 1/8W; Supplier: Digikey; Digikey Part Numer: CR0603-JW-104ELFTR-ND; Supplier 1: Digi-Key; Supplier Part Number 1: 2019-RK73B1JTTD270JCT-ND
R?#8 = RESISTOR_1M_0603: RES 1M OHM 1/8W 0603; Tolerance: +/- 5%; Made By: Robert Pafford; ComponentLink1Description: Datasheet; ComponentLink1URL: https://www.bourns.com/docs/product-datasheets/CRxxxxx.pdf; Wattage: 1/8W; Supplier: Digikey; Digikey Part Numer: CR0603-JW-104ELFTR-ND; Supplier 1: Digi-Key; Supplier Part Number 1: RMCF0603JT1M00CT-ND; Value  (Ohms): 1M
U?#1 = MBRB2545CT: Diode Array 1 Pair Common Cathode 45 V Surface Mount TO-263-3, D²Pak (2 Leads + Tab), TO-263AB; Mfr_Name: Vishay; Copyright: Copyright (C) 2023 Ultra Librarian. All rights reserved.; Manufacturer_Part_Number: MBRB2545CT; RefDes: RefDes; Type: DEV; ComponentLink1Description: Supplier Link; ComponentLink1URL: https://www.digikey.com/en/products/detail/smc-diode-solutions/MBRB2545CT/6022901
U?#2 = LTC4412ES6TRPBF: OR Controller Source Selector Switch P-Channel 2:1 TSOT-23-6; MP: LTC4412ES6#TRPBF; MF: Analog Devices; Price: None; Availability: Good; Mouser-Purchase-URL: https://snapeda.com/shop?store=Mouser&id=4343773; Arrow_Europe-Purchase-URL: https://snapeda.com/shop?store=Arrow+Europe&id=4343773; DigiKey-Purchase-URL: https://snapeda.com/shop?store=DigiKey&id=4343773; Package: SOT-23-6 Analog Devices; SnapEDA_Link: https://www.snapeda.com/parts/LTC4412ES6%23TRPBF/Analog%20Devices/view-part/4343773/?ref=snap; Value: *; Check_prices: https://www.snapeda.com/parts/LTC4412ES6%23TRPBF/Analog%20Devices/view-part/4343773/?ref=eda; Supplier 1: Mouser; Supplier Part Number 1: 584-LTC4412ES6#TRPBF
U?#3 = DG448DV-T1-E3: as U13 on sheet Poactuator_KillSwitch; Copyright: Copyright (C) 2024 Ultra Librarian. All rights reserved.; Manufacturer_Part_Number: DG448DV-T1-E3; RefDes: RefDes; Type: DEV; Supplier 1: Mouser; Supplier Part Number 1: 781-DG448DV-E3

## Sheet SBH_BMS.SchDoc: Sample Sheet Title
size B; Date: 12/31/2022; Author: Flip B; Organization: ORGANIZATION; Address1: ADDRESS 1; Address2: ADDRESS 2; Address3: ADDRESS 3; Address4: ADDRESS 4; DocumentNumber: 1; Revision: -; SheetNumber: 1; SheetTotal: 8; ENG_APP_DATE: --/--/--; DSN_APP_DATE: --/--/--; CHK_APP_DATE: --/--/--
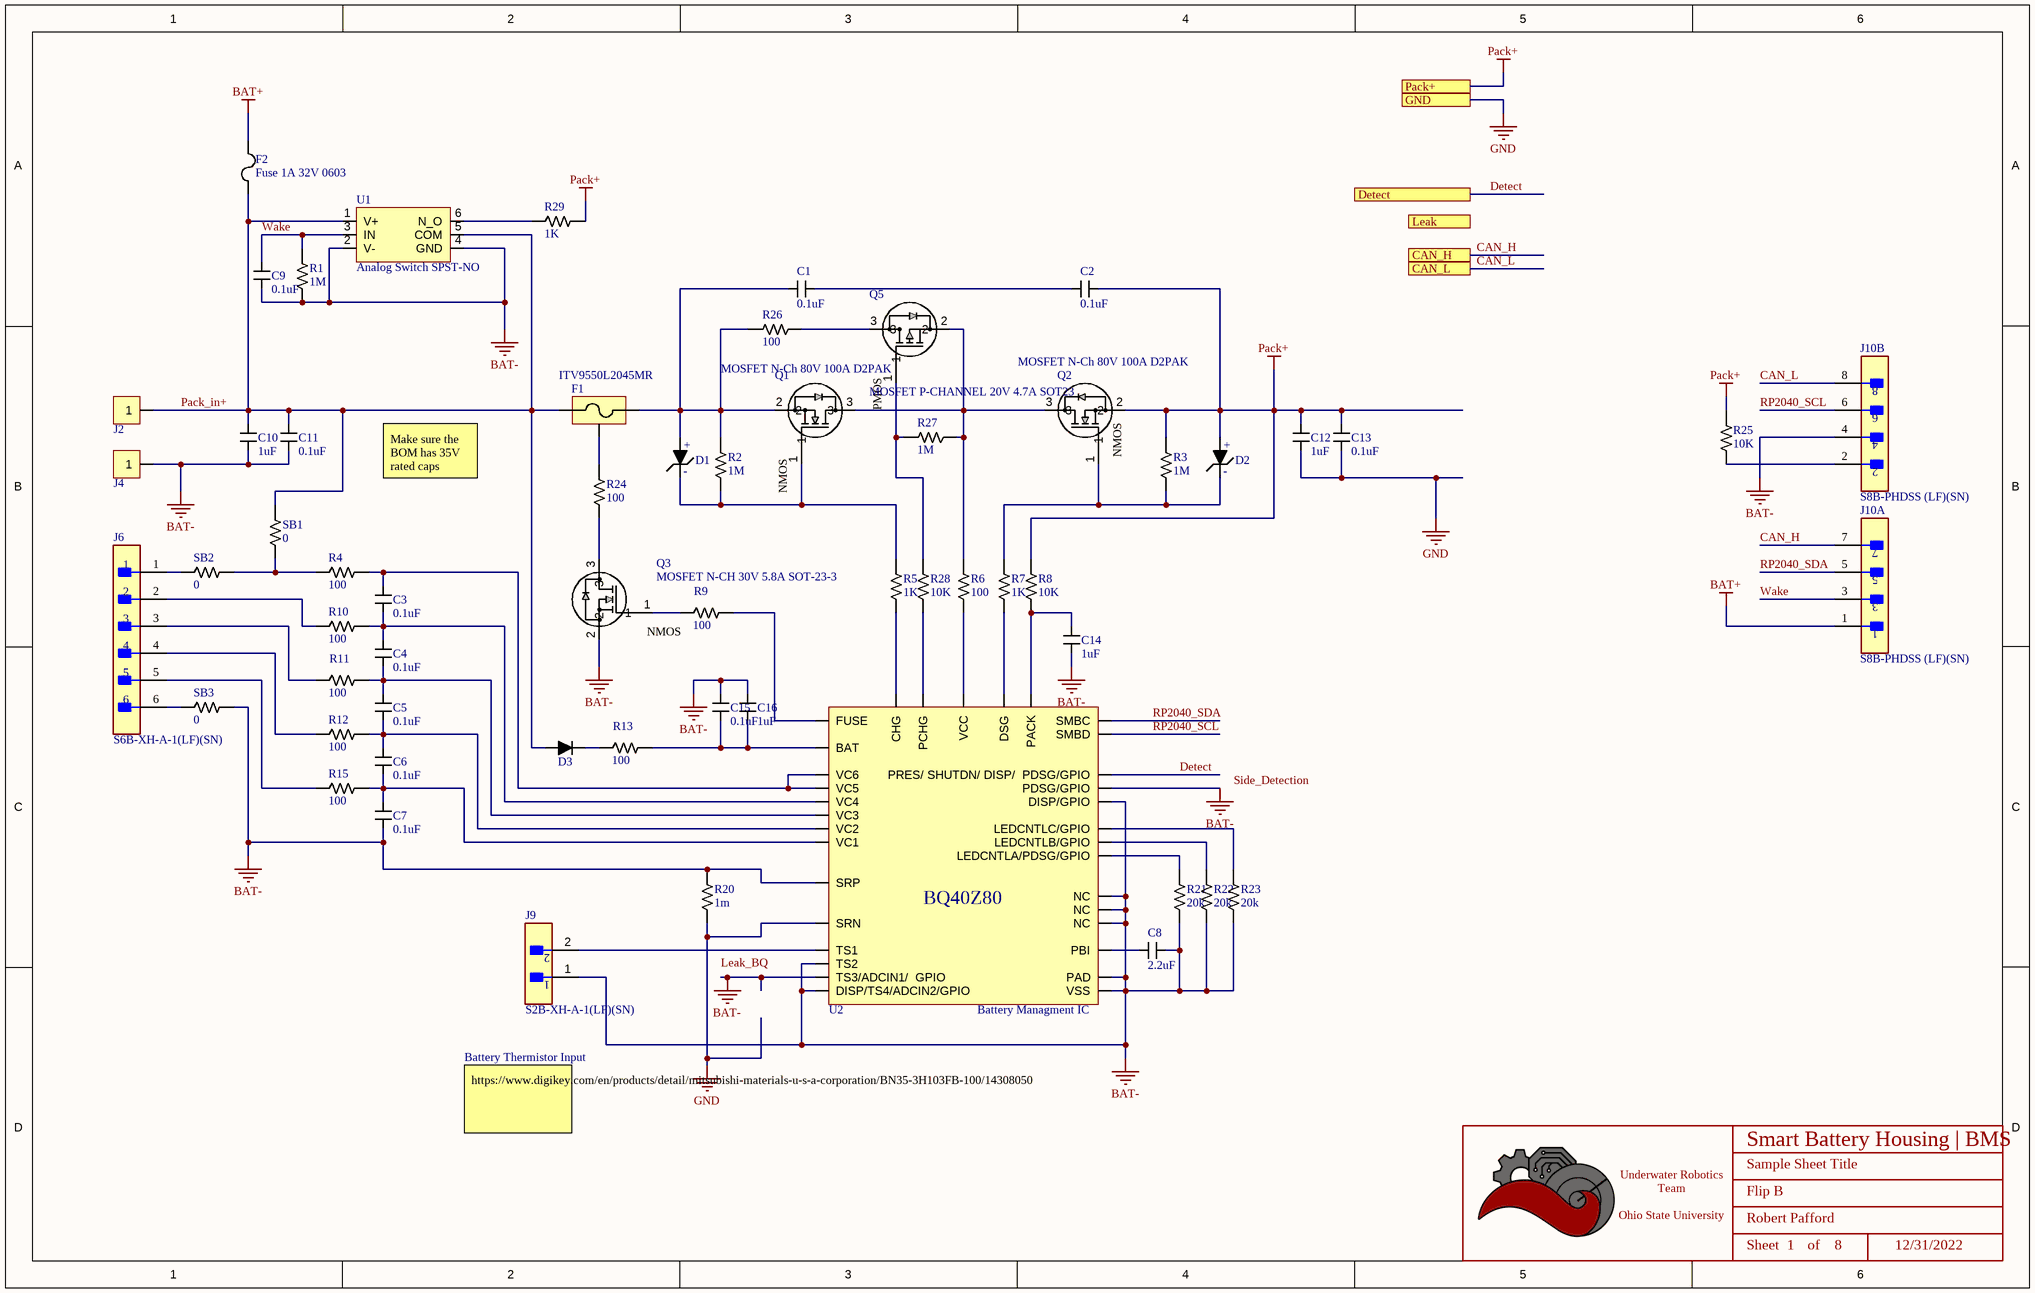
[diagram p4: SBH_BMS.SchDoc]

### Parts
(Parts that share a designator on the sheet are numbered #1, #2 ... from top to bottom, then left to right.)
*#5  Title_Block  [LOGO]  (value not drawn)  (graphical)
C1  value 0.1uF  [CAPACITOR_0402]  (hidden comment: 100nF Ceramic 25V)
C2  value 0.1uF  [CAPACITOR_0402]  (hidden comment: 100nF Ceramic 25V)
C3  value 0.1uF  [CAPACITOR_0402]  (hidden comment: 100nF Ceramic 25V)
C4  value 0.1uF  [CAPACITOR_0402]  (hidden comment: 100nF Ceramic 25V)
C5  value 0.1uF  [CAPACITOR_0402]  (hidden comment: 100nF Ceramic 25V)
C6  value 0.1uF  [CAPACITOR_0402]  (hidden comment: 100nF Ceramic 25V)
C7  value 0.1uF  [CAPACITOR_0402]  (hidden comment: 100nF Ceramic 25V)
C8  value 2.2uF  [CAPACITOR_0402]  (hidden comment: 2.2uF Ceramic 35V)
C9  value 0.1uF  [CAPACITOR_0402]  (hidden comment: 100nF Ceramic 25V)
C10  value 1uF  [CAPACITOR_0402]  (hidden comment: 1uF Ceramic 16V)
C11  value 0.1uF  [CAPACITOR_0402]  (hidden comment: 100nF Ceramic 25V)
C12  value 1uF  [CAPACITOR_0402]  (hidden comment: 1uF Ceramic 16V)
C13  value 0.1uF  [CAPACITOR_0402]  (hidden comment: 100nF Ceramic 25V)
C14  value 1uF  [CAPACITOR_0402]  (hidden comment: 1uF Ceramic 16V)
C15  value 0.1uF  [CAPACITOR_0402]  (hidden comment: 100nF Ceramic 25V)
C16  value 1uF  [CAPACITOR_0402]  (hidden comment: 1uF Ceramic 16V)
D1  Zener_Diode_16V_500mW  [SOD-123]  (value not drawn)
D2  Zener_Diode_16V_500mW  [SOD-123]  (value not drawn)
D3  MBR0520LT3G  [SOD-123]  (value not drawn)
F1  ITV9550L2045MR  [ITV9550]
F2  Fuse 1A 32V 0603  [2-SMD Fuse 0603]
J2  Redcube M4 Term 85A  [Redcube M4 Term 85A]  (value not drawn)
J4  Redcube M4 Term 85A  [Redcube M4 Term 85A]  (value not drawn)
J6  S6B-XH-A-1(LF)(SN)  [FP-S6B-XH-A-1_LF_SN-MFG]
J9  S2B-XH-A-1(LF)(SN)  [FP-S2B-XH-A-1_LF_SN-MFG]
J10  S8B-PHDSS (LF)(SN)  [FP-S8B-PHDSS_LF_SN-MFG]  (parts A,B of 2)
Q1  MOSFET N-Ch 80V 100A D2PAK  [D2PAK]
Q2  MOSFET N-Ch 80V 100A D2PAK  [D2PAK]
Q3  MOSFET N-CH 30V 5.8A SOT-23-3  [SOT-23-3]
Q5  MOSFET P-CHANNEL 20V 4.7A SOT23  [SOT-23-3]
R1  1M  [RESISTOR_0603]
R2  1M  [RESISTOR_0603]
R3  1M  [RESISTOR_0603]
R4  Value  (Ohms): 100  [RESISTOR_0402]  (hidden comment: 100 Ohm 5% 1/16W)
R5  Value  (Ohms): 1K  [RESISTOR_0402]  (hidden comment: 1k Ohm 1% 1/16W)
R6  Value  (Ohms): 100  [RESISTOR_0402]  (hidden comment: 100 Ohm 5% 1/16W)
R7  Value  (Ohms): 1K  [RESISTOR_0402]  (hidden comment: 1k Ohm 1% 1/16W)
R8  Value  (Ohms): 10K  [RESISTOR_0402]  (hidden comment: 10k Ohm 1% 1/16W)
R9  Value  (Ohms): 100  [RESISTOR_0402]  (hidden comment: 100 Ohm 5% 1/16W)
R10  Value  (Ohms): 100  [RESISTOR_0402]  (hidden comment: 100 Ohm 5% 1/16W)
R11  Value  (Ohms): 100  [RESISTOR_0402]  (hidden comment: 100 Ohm 5% 1/16W)
R12  Value  (Ohms): 100  [RESISTOR_0402]  (hidden comment: 100 Ohm 5% 1/16W)
R13  Value  (Ohms): 100  [RESISTOR_0402]  (hidden comment: 100 Ohm 5% 1/16W)
R15  Value  (Ohms): 100  [RESISTOR_0402]  (hidden comment: 100 Ohm 5% 1/16W)
R20  Value  (Ohms): 1m  [RES_CSS2H-3920]  (hidden comment: 1m Ohm 5% 8W)
R21  Value  (Ohms): 20k  [RESISTOR_0402]  (hidden comment: 20k Ohm 1% 1/16W)
R22  Value  (Ohms): 20k  [RESISTOR_0402]  (hidden comment: 20k Ohm 1% 1/16W)
R23  Value  (Ohms): 20k  [RESISTOR_0402]  (hidden comment: 20k Ohm 1% 1/16W)
R24  Value  (Ohms): 100  [RESISTOR_0402]  (hidden comment: 100 Ohm 5% 1/16W)
R25  Value  (Ohms): 10K  [RESISTOR_0603]  (hidden comment: 10k Ohm 5% 1/10W)
R26  Value  (Ohms): 100  [RESISTOR_0402]  (hidden comment: 100 Ohm 5% 1/16W)
R27  1M  [RESISTOR_0603]
R28  Value  (Ohms): 10K  [RESISTOR_0402]  (hidden comment: 10k Ohm 1% 1/16W)
R29  Value  (Ohms): 1K  [RESISTOR_0603]  (hidden comment: 1k Ohm 5% 1/8W)
SB1  Value  (Ohms): 0  [RESISTOR_0603]  (hidden comment: 0 Ohm Jumper No Fit)
SB2  Value  (Ohms): 0  [RESISTOR_0603]  (hidden comment: 0 Ohm Jumper No Fit)
SB3  Value  (Ohms): 0  [RESISTOR_0603]  (hidden comment: 0 Ohm Jumper No Fit)
U1  Analog Switch SPST-NO  [TSOT-23_S6]
U2  Battery Managment IC  [VQFN-32]

### Ports
CAN_H, CAN_L, Detect, GND, Leak, Pack+

### Nets
BAT+: F2.2 J10.1
BAT-: C7.2 C8.1 C9.2 C10.2 C11.2 C14.2 C15.1 C16.1 J4.1 J9.1 J10.4 Q3.2 R1.2 R20.1 R21.2 R22.2 R23.2 SB3.1 U1.2(V-) U1.4(GND) U2.7(NC) U2.8(SRP) U2.9(VSS) U2.11(TS2) U2.12(TS3/ADCIN1/__GPIO) U2.13(DISP/TS4/ADCIN2/GPIO) U2.14(NC) U2.15(DISP/GPIO) U2.16(PDSG/GPIO) U2.27(NC) U2.33(PAD)
GND: C12.2 C13.2 R20.2 U2.6(SRN) ; port GND  [project net dGND]
Pack+: C2.1 C12.1 C13.1 D2.1 Q2.2 R3.1 R8.1 R25.1 R29.1 ; port Pack+
CAN_H: J10.7 ; port CAN_H
CAN_L: J10.8 ; port CAN_L
Detect: U2.17(PRES/_SHUTDN/_DISP/__PDSG/GPIO) ; port Detect
Pack_in+: C10.1 C11.1 D3.1 F1.2 F2.1 J2.1 SB1.1 U1.1(V+) U1.5(COM)
RP2040_SCL: J10.6 U2.18(SMBD)
RP2040_SDA: J10.5 U2.19(SMBC)
Wake: C9.1 J10.3 R1.1 U1.3(IN)
NetC1_1: C1.1 C2.2
NetC1_2: C1.2 D1.1 F1.1 Q1.2 R2.1 R26.1
NetC3_1: C3.1 R4.1 U2.1(VC5) U2.32(VC6)
NetC3_2: C3.2 C4.1 R10.1 U2.2(VC4)
NetC4_2: C4.2 C5.1 R11.1 U2.3(VC3)
NetC5_2: C5.2 C6.1 R12.1 U2.4(VC2)
NetC6_2: C6.2 C7.1 R15.1 U2.5(VC1)
NetC8_2: C8.2 U2.31(PBI)
NetC14_1: C14.1 R8.2 U2.25(PACK)
NetC15_2: C15.2 C16.2 R13.1 U2.30(BAT)
NetD1_2: D1.2 Q1.1 R2.2 R5.1
NetD2_2: D2.2 Q2.1 R3.2 R7.1
NetD3_2: D3.2 R13.2
NetF1_3: F1.3 R24.1
NetJ6_1: J6.1 SB2.2
NetJ6_2: J6.2 R10.2
NetJ6_3: J6.3 R11.2
NetJ6_4: J6.4 R12.2
NetJ6_5: J6.5 R15.2
NetJ6_6: J6.6 SB3.2
NetJ9_2: J9.2 U2.10(TS1)
NetJ10_2: J10.2 R25.2
NetQ1_3: Q1.3 Q2.3 Q5.2 R6.1 R27.2
NetQ3_1: Q3.1 R9.2
NetQ3_3: Q3.3 R24.2
NetQ5_1: Q5.1 R27.1 R28.1
NetQ5_3: Q5.3 R26.2
NetR4_2: R4.2 SB1.2 SB2.1
NetR5_2: R5.2 U2.29(CHG)
NetR6_2: R6.2 U2.24(VCC)
NetR7_2: R7.2 U2.26(DSG)
NetR9_1: R9.1 U2.23(FUSE)
NetR21_1: R21.1 U2.20(LEDCNTLA/PDSG/GPIO)
NetR22_1: R22.1 U2.21(LEDCNTLB/GPIO)
NetR23_1: R23.1 U2.22(LEDCNTLC/GPIO)
NetR28_2: R28.2 U2.28(PCHG)
NetR29_2: R29.2 U1.6(N_O)

### Notes on the sheet
- Make sure the BOM has 35V rated caps
- Battery Thermistor Input
- https://www.digikey.com/en/products/detail/mitsubishi-materials-u-s-a-corporation/BN35-3H103FB-100/14308050
- Labels drawn without touching a wire or pin: Leak_BQ, Side_Detection
- DWG. NO.
- REV.
- SHT.
- THIS DOCUMENT AND THE DATA DISCLOSED HEREIN OR HEREWITH IS THE PROPERTY OF ALTIUM LIMITED AND MAY BE FREELY DISTRIBUTED IN WHOLE. NO RIGHTS ARE RESERVED OR EXPRESS OR IMPLIED WARANTEE GIVEN.
- REVISION
- DESCRIPTION
- DATE
- APPROVED
- ENG:
- APPROVALS
- PROJECT
- DSN:
- CHK:
- REFERENCE DOCUMENTS
- PROJECT REVISION:
- TITLE
- DOCUMENT REVISION:
- DESIGN ITEM:
- BOM:
- FAB DWG:
- PCB DWG:
- ASSY DWG:
- SCALE:
- SIZE
- B
- CAGE CODE
- FILE NAME
- DWG NO.
- SHEET
- OF
- REV
- (in symbol AO3404A) NMOS
- (in symbol BQ40Z80RSMT) BQ40Z80
- (in symbol PSMN4R4-80BS,118) NMOS
- (in symbol Title_Block) Underwater Robotics Team / Ohio State University; Sheet; of
- (in symbol TSM500P02CX) PMOS
- (in symbol Zener_Diode_16V_500mW) +; -

### Library data of the parts
*#5 = Title_Block: as *#1 on sheet Poactuator_Connectors
C1-C7 C9 C11 C13 C15 = CAPACITOR_0.1uF_0402: Cap 100nF 25V +/-10% / Ceramic 0402; Made By: Robert Pafford; Tolerance: +/- 10%; Voltage: 25V; Supplier 1: Digi-Key; Supplier Part Number 1: 478-7868-1-ND
C8 = CAPACITOR_2.2uF_0402: Cap 2.2uF 35V +/-10% / Ceramic 0402; Made By: Flip B; Tolerance: +/- 10%; Voltage: 35V; Supplier 1: Digi-Key; Supplier Part Number 1: 445-9028-1-ND
C10 C12 C14 C16 = CAPACITOR_1uF_0402: Cap 1uF 16V +/-10% / Ceramic 0402; Made By: Robert Pafford; Tolerance: +/- 10%; Voltage: 16V; Supplier 1: Digi-Key; Supplier Part Number 1: 478-0402YD105KAT4ADKR-ND
D1 D2 = Zener_Diode_16V_500mW: Zener Diode | 16 V | 500 mW | SOD-123; Made By: Flip B; Voltage - Zener: 16V; Power: 500mW; Package: SOD-123; ComponentLink1Description: Datasheet; ComponentLink1URL: https://www.panjit.com.tw/upload/datasheet/MMSZ5229A_SERIES.pdf; Supplier 1: Digi-Key; Supplier Part Number 1: 3757-MMSZ5246A_R1_00001CT-ND
D3 = SCHOTTKY_20V_500mA: Schottky Diode, 20V reverse breakdown, 500mA, Vf = 0.385V; Made By: Flip B; ComponentLink1Description: Datasheet; ComponentLink1URL: https://www.onsemi.com/pdf/datasheet/mbr0520lt1-d.pdf; Forward Voltage: 0.385V; Forward Current: 500mA; Package: SOD-123; Supplier 1: Digi-Key; Supplier Part Number 1: MBR0520LT3GOSCT-ND
F1 = ITV9550L2045MR: LittelFuse  | 45A | 5S | SMD | Self-Control Protector; Mfr_Name: Littelfuse Inc; Voltage Rating: 85V; Response Time: >1min for 2x45A; Breaking Capacity: 120A; Manufacturer_Part_Number: ITV9550L2045MR; Current Rating: 45A; Package: Proprietary; Created By: Flip B
F2 = ERB-RE1R00V: Pansonic | 32V | 1A | 0603 | Fast Blow; Mfr_Name: Panasonic; Breaking Capacity: 150A; Manufacturer_Part_Number: ERB-RE1R00V; Current Rating: 1A; Voltage Rating: 32V; Response Time: Fast Blow; Package: 1206; Created By: Nathan Ayer; Supplier 1: Digi-Key; Supplier Part Number 1: P15124CT-ND
J6 = CMP-17439-000023-1: CONN HEADER R/A P6OS 2.5MM; Voltage Rating: 250V; Insulation Resistance: 1GR; Current Rating: 3A; Number of Positions: 6; Gender: Male; Mount: Through Hole; Material: Polyamide; Max Operating Temperature: 85°C; Contact Plating: Tin; Number of Rows: 1; Color: Natural; Termination: Crimp; Min Operating Temperature: -25°C; Pitch: 2.5mm; Lead Free: Lead Free; Contact Material: Brass
J9 = CMP-17439-000260-1: CONN HEADER R/A 2POS 2.5MM; Voltage Rating: 250V; Number of Positions: 2; Contact Material: Brass; Series: XH; Contact Finish - Mating: TIN; Max Operating Temperature: 85°C; Number of Rows: 1; Packaging: Bulk; Insulation Color: Natural; Lead Free: Lead Free; Fastening Type: Detent; Termination: Press-Fit; Connector Type: Header; Insulation Material: Nylon; Contact Shape: Square; Contact Type: Male Pin; Mount: Through Hole; Min Operating Temperature: -25°C; Flammability Rating: UL94 V-0
J10 = CMP-17439-000572-2: CONN HEADER R/A 8POS 2MM; Row Spacing: 0.079inch; Voltage Rating: 250V; Number of Positions: 8; Fastening Type: Detent; Contact Finish - Mating: TIN; Mount: Through Hole; Connector Type: Header; Contact Plating: Tin; Contact Shape: Square; Insulation Material: Nylon; Contact Material: Copper Alloy; Termination: Solder; Packaging: Bulk; Series: PHD; Flammability Rating: UL94 V-0; Pitch: 2mm; Lead Free: Lead Free; Number of Rows: 2; Contact Type: Male Pin; Contact Mating Length: 0.114inch; Color: Natural; Insulation Color: Natural
Q1 Q2 = PSMN4R4-80BS,118: N-Channel 80V 100A (Ta) 306W (Ta), Surface Mount D2PAK; Vendor: Nexperia USA Inc.; Vgs (Max): +/- 20 V; Vgs (th): 3V; Rds (on): 3.8mOhm @ 25A, 10Vgs; Amp Rating: 100A; FET Type: N-Channel; Package: D2PAK; Manufacturer _Part_Number: PSMN4R4-80BS,118; Vdss: 80 V; Power Dissipation: 306W; Created By: Flip B; Supplier 1: Digi-Key; Supplier Part Number 1: 1727-7123-1-ND
Q3 = AO3404A: as Q7 on sheet Poactuator_KillSwitch; Amp Rating: 5.8 A; FET Type: N-Channel; Package: SOT23-3L; Manufacturer _Part_Number: AO3404A; Vdss: 30V; Power Dissipation: 1.4W (Ta); Supplier 1: Digi-Key; Supplier Part Number 1: 785-1004-1-ND; Created By: Dylan T
Q5 = TSM500P02CX: P-Channel 20 V 4.7A (Tc) 1.56W (Tc) Surface Mount SOT-23; Vendor: Taiwan Semiconductor Corporation; Vgs (Max): ±10V; Vgs (th): 800mV @ 250µA; Rds (on): 50mOhm @ 3A, 4.5V; Amp Rating: 4.7 A; FET Type: P-Channel; Package: TO-236-3, SC-59, SOT-23-3; Manufacturer_Part_Number: TSM500P02CX; Vdss: 20 V; Power Dissipation: 1.56W (Tc); Created By: Robert Pafford; Supplier 1: Digi-Key; Supplier Part Number 1: TSM500P02CXRFGCT-ND
R1-R3 R27 = RESISTOR_1M_0603: as R?#8 on sheet Chrg_Discharge_cntrl; ComponentLink1Description: Datasheet; ComponentLink1URL: https://www.bourns.com/docs/product-datasheets/CRxxxxx.pdf; Wattage: 1/8W; Supplier: Digikey; Digikey Part Numer: CR0603-JW-104ELFTR-ND; Supplier 1: Digi-Key; Supplier Part Number 1: RMCF0603JT1M00CT-ND; Value  (Ohms): 1M
R4 R6 R9-R13 R15 R24 R26 = RESISTOR_100_0402: RES 100 OHM 5% 1/16W 0402; Tolerance: +/- 5%; Made By: Flip B; Wattage: 1/16W; Supplier: Digikey; Digikey Part Numer: 311-100JRTR-ND; Supplier 1: Digi-Key; Supplier Part Number 1: 311-100JRCT-ND
R5 R7 = RESISTOR_1K_0402: as R45 on sheet Poactuator_KillSwitch; Wattage: 1/16W; Supplier: Digikey; Digikey Part Numer: CR0603-JW-104ELFTR-ND; Supplier 1: Digi-Key; Supplier Part Number 1: 13-AC0402FR-131KLCT-ND
R8 R28 = RESISTOR_10K_0402: RES 10k OHM 1% 1/16W 0402; Tolerance: +/- 1%; Made By: Robert Pafford; Wattage: 1/16W; Supplier: Digikey; Digikey Part Numer: CR0603-JW-104ELFTR-ND; Supplier 1: Digi-Key; Supplier Part Number 1: YAG3436CT-ND
R20 = RESISTOR_1m_CS: RES 1m OHM 1% 8W Current Sense; Tolerance: +/- 1%; Made By: Flip B; ComponentLink1Description: Datasheet; ComponentLink1URL: https://www.bourns.com/docs/product-datasheets/css2h-3920.pdf; Wattage: 8W; Supplier 1: Digi-Key; Supplier Part Number 1: CSS2H-3920R-1L00FCT-ND
R21-R23 = RESISTOR_20K_0402: RES 20k OHM 1% 1/16W 0402; Tolerance: +/- 1%; Made By: Flip B; Wattage: 1/16W; Supplier 1: Digi-Key; Supplier Part Number 1: 311-20.0KLRCT-ND
R25 = RESISTOR_10K_0603: as R37 on sheet Poactuator_Microcontroller; ComponentLink1Description: Datasheet; ComponentLink1URL: https://www.bourns.com/docs/product-datasheets/CRxxxxx.pdf; Supplier: Digikey; Digikey Part Numer: CR0603-JW-104ELFTR-ND; Supplier 1: Digi-Key; Supplier Part Number 1: 2019-RK73B1JTTD103JCT-ND
R29 = RESISTOR_1K_0603: as R42 on sheet Poactuator_Connectors; ComponentLink1Description: Datasheet; ComponentLink1URL: https://www.bourns.com/docs/product-datasheets/CRxxxxx.pdf; Wattage: 1/8W; Supplier: Digikey; Digikey Part Numer: CR0603-JW-104ELFTR-ND; Supplier 1: Digi-Key; Supplier Part Number 1: 2019-RK73B1JTTD102JCT-ND
SB1-SB3 = JUMPER_0_0603: 0 Ohm Jumper No Fit for Solder Bridge; Made By: Robert Pafford; ComponentLink1Description: Digikey; ComponentLink1URL: https://www.digikey.com/en/products/detail/koa-speer-electronics-inc/RK73B1JTTD101J/9844701
U1 = MAX4520EUT+T: Analog Switch SPST Normally Open; MF: Analog Devices; On resistance: 160Ohm; Voltage: 9-36V; Package: SOT-23-6 Analog Devices; Circuit: SPST; Created By: Flip B; ComponentLink1Description: Datasheet; ComponentLink1URL: https://www.analog.com/media/en/technical-documentation/data-sheets/max4510-max4520.pdf; Supplier 1: Digi-Key; Supplier Part Number 1: MAX4520EUT+TCT-ND
U2 = BQ40Z80RSMT: Multifuntion Li-ion/ Lipo Battery Pack Managment IC; Manufacturer: Texas Instruments; No. Of Cells: 2S-6S; Supply Voltage: 2.2V - 32V; Quiescent Current: 50mA; ComponentLink1Description: Datasheet; ComponentLink1URL: https://www.ti.com/lit/ds/symlink/bq40z80.pdf?HQS=dis-dk-null-digikeymode-dsf-pf-null-wwe&ts=1672534896638&ref_url=https%253A%252F%252Fwww.ti.com%252Fgeneral%252Fdocs%252Fsuppproductinfo.tsp%253FdistId%253D10%2526gotoUrl%253Dhttps%253A%252F%252Fwww.ti.com%252Flit%252Fgpn%252Fbq40z80; Created By: Flip B; PartNumber: BQ40Z80RSMT; Supplier 1: Digi-Key; Supplier Part Number 1: 296-BQ40Z80RSMTCT-ND
J2 J4 = Redcube M4 Term 85A: Created By: Nahtan Ayer; Current Rating: 85 A; Screw Size: M4

## Nets that join several sheets
3V3: Poactuator_Connectors (R39.1), Poactuator_Microcontroller (9 pins), Poactuator_KillSwitch (R35.1)
5V: Poactuator_Connectors (J1.9 J8.2 R42.1), Poactuator_Microcontroller (R52.1)
12V: Poactuator_Connectors (J1.7 R41.1), Poactuator_Microcontroller (Q10.D R37.1 R51.1)
dGND: Poactuator_Connectors (22 pins), Poactuator_Microcontroller (16 pins), Poactuator_KillSwitch (9 pins), Chrg_Discharge_cntrl (5 pins), SBH_BMS (C12.2 C13.2 R20.2 U2.6)
MOTOR_PWR: Poactuator_Connectors (J3.1 R46.1), Poactuator_KillSwitch (Q8.D Q9.D)
Pack+: Chrg_Discharge_cntrl (8 pins), SBH_BMS (9 pins)
V+: Poactuator_Connectors (R44.1), Poactuator_KillSwitch (13 pins), Chrg_Discharge_cntrl (9 pins)
Vreg: Poactuator_Connectors (J1.10 J1.11 R40.1), Poactuator_Microcontroller (R50.1)
AUX_SWITCH: Poactuator_Connectors (J5.3), Poactuator_Microcontroller (R34.2)
KILL_SWITCH: Poactuator_Connectors (J5.4), Poactuator_KillSwitch (R49.2)
Orin_PWR: Poactuator_Connectors (J14.2), Poactuator_Microcontroller (Q10.1 Q10.2 Q10.3 R19.1)